# EAGLE design board (EAGLE 6.5.0)
Teensy 3.0 to Arduino R3 compatible shield adapter
Assembly variants: no charger, FULL

## Sheet 1 of 3
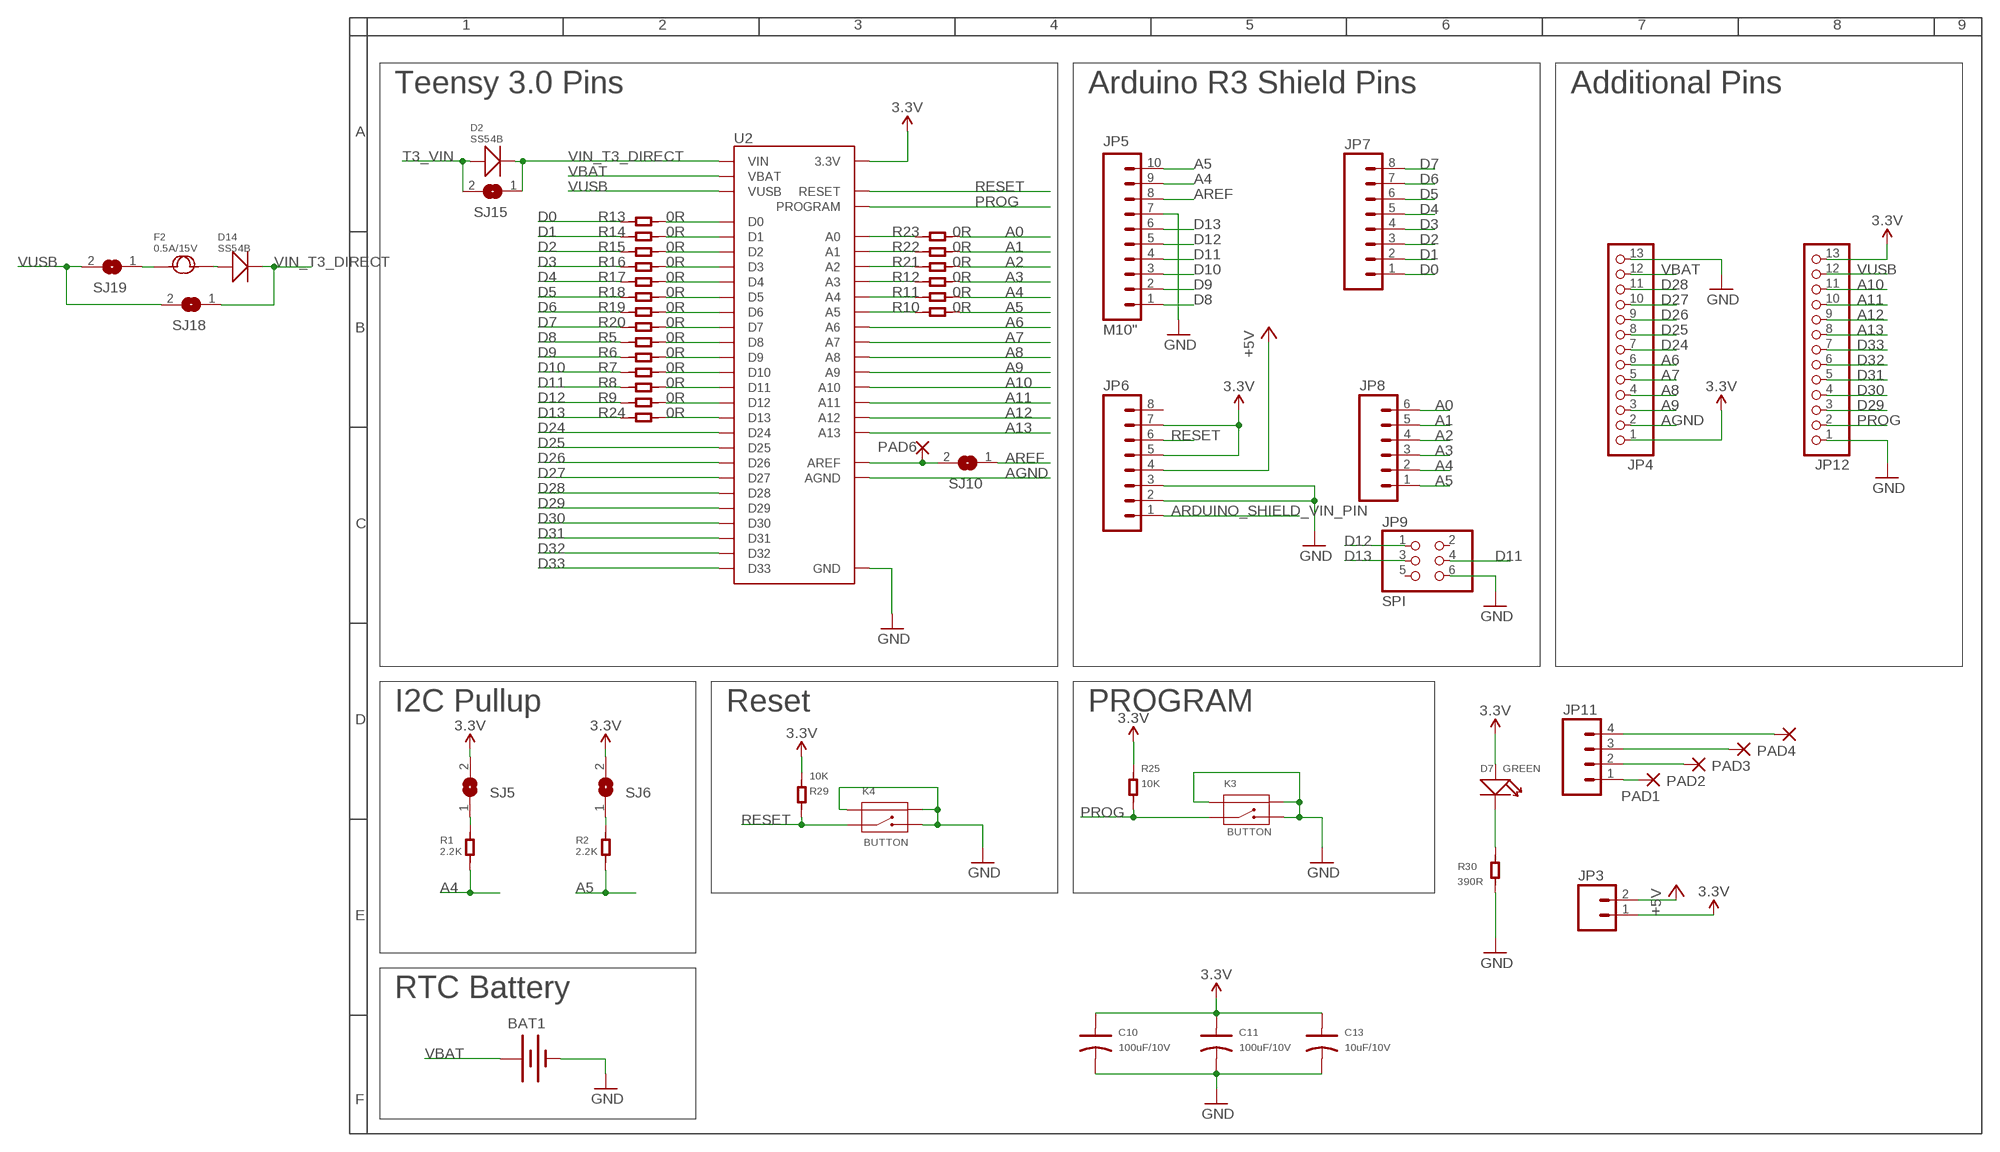
[diagram p0: schematic, sheet 1]

### Parts
BAT1  BATTERY12MM  [BATTCON_12MM]
C10  100uF/10V  C-POLAR-C  [AVX-C]  (not fitted in variant no charger)  (not fitted in variant FULL)
C11  100uF/10V  C-POLAR-C  [AVX-C]  (not fitted in variant no charger)  (not fitted in variant FULL)
C13  10uF/10V  C-POLAR-B  [AVX-B]  (not fitted in variant FULL)
D2  SS54B  D-SMB  [SMB]
D7  GREEN  LED  [LED0603]
D14  SS54B  D-SMB  [SMB]
F2  0.5A/15V  FUSE-1812  [F1812]
JP3  M02PTH  [1X02]
JP4  PINHD-1X13_BIG  [1X13-BIG]
JP5  M10"  [1X10]
JP6  M081X08  [1X08]
JP7  M081X08  [1X08]
JP8  M06SIP  [1X06]
JP9  SPI  PINHD-2X3  [2X03]
JP11  M04PTH  [1X04]
JP12  PINHD-1X13_BIG  [1X13-BIG]
K3  BUTTON  BUTTON-2P-REINFORCE-3100060P1  [4P-SMD-7.0X3.5X3.5H-90D]
K4  BUTTON  BUTTON-2P-REINFORCE-3100060P1  [4P-SMD-7.0X3.5X3.5H-90D]
PAD1  WIREPADSMD1,27-254  [SMD1,27-2,54]
PAD2  WIREPADSMD1,27-254  [SMD1,27-2,54]
PAD3  WIREPADSMD1,27-254  [SMD1,27-2,54]
PAD4  WIREPADSMD1,27-254  [SMD1,27-2,54]
PAD6  AREF  SMD2  [SMD1,27-2,54]
R1  2.2K  R-0603  [R0603]
R2  2.2K  R-0603  [R0603]
R5  0R  R-0603  [R0603]
R6  0R  R-0603  [R0603]
R7  0R  R-0603  [R0603]
R8  0R  R-0603  [R0603]
R9  0R  R-0603  [R0603]
R10  0R  R-0603  [R0603]
R11  0R  R-0603  [R0603]
R12  0R  R-0603  [R0603]
R13  0R  R-0603  [R0603]
R14  0R  R-0603  [R0603]
R15  0R  R-0603  [R0603]
R16  0R  R-0603  [R0603]
R17  0R  R-0603  [R0603]
R18  0R  R-0603  [R0603]
R19  0R  R-0603  [R0603]
R20  0R  R-0603  [R0603]
R21  0R  R-0603  [R0603]
R22  0R  R-0603  [R0603]
R23  0R  R-0603  [R0603]
R24  0R  R-0603  [R0603]
R25  10K  R-0603  [R0603]
R29  10K  R-0603  [R0603]
R30  390R  R-0603  [R0603]
SJ5  JUMPER_2WLARGE  [JUMPER_LARGE_2WAY]
SJ6  JUMPER_2WLARGE  [JUMPER_LARGE_2WAY]
SJ10  JUMPER_2WLARGE  [JUMPER_LARGE_2WAY]
SJ15  JUMPER_2WLARGE  [JUMPER_LARGE_2WAY]
SJ18  JUMPER_2WLARGE  [JUMPER_LARGE_2WAY]
SJ19  JUMPER_2WLARGE  [JUMPER_LARGE_2WAY]
U2  TEENSY3.0_ALLPINSSILK  [TEENSY3.0_ALLPINS/SILK]

### Nets
3.3V [MOREPOWER]: C10.+ C11.+ C13.+ D7.+ JP3.1 JP4.1 JP6.5 JP6.7 JP12.13 R25.2 R29.2 SJ5.2 SJ6.2 U2.3V3_A(3.3V) U2.3V3_B(3.3V) U2.3V3_C(3.3V) ; also sheet 2,3
+5V [MOREPOWER]: JP3.2 JP6.4 ; also sheet 3
A0: JP8.6 R23.1
A1: JP8.5 R22.1
A2: JP8.4 R21.1
A3: JP8.3 R12.1
A4: JP5.9 JP8.2 R1.1 R11.1
A5: JP5.10 JP8.1 R2.1 R10.1
A6: JP4.6 U2.A6
A7: JP4.5 U2.A7
A8: JP4.4 U2.A8
A9: JP4.3 U2.A9
A10: JP12.11 U2.A10
A11: JP12.10 U2.A11
A12: JP12.9 U2.A12
A13: JP12.8 U2.A13
AGND: JP4.2 U2.AGND
ARDUINO_SHIELD_VIN_PIN [MOREPOWER]: JP6.1 ; also sheet 3
AREF: JP5.8 SJ10.1
D0: JP7.1 R13.2 ; also sheet 2
D1: JP7.2 R14.2 ; also sheet 2
D2: JP7.3 R15.2 ; also sheet 2
D3: JP7.4 R16.2
D4: JP7.5 R17.2 ; also sheet 2
D5: JP7.6 R18.2
D6: JP7.7 R19.2 ; also sheet 2,3
D7: JP7.8 R20.2 ; also sheet 3
D8: JP5.1 R5.2 ; also sheet 3
D9: JP5.2 R6.2 ; also sheet 2
D10: JP5.3 R7.2 ; also sheet 2
D11: JP5.4 JP9.4 R8.2 ; also sheet 2
D12: JP5.5 JP9.1 R9.2 ; also sheet 2
D13: JP5.6 JP9.3 R24.2 ; also sheet 2
D24: JP4.7 U2.D24 ; also sheet 2
D25: JP4.8 U2.D25 ; also sheet 2
D26: JP4.9 U2.D26
D27: JP4.10 U2.D27
D28: JP4.11 U2.D28
D29: JP12.3 U2.D29
D30: JP12.4 U2.D30
D31: JP12.5 U2.D31
D32: JP12.6 U2.D32
D33: JP12.7 U2.D33
DIRECT_AREF: PAD6.1(P) SJ10.2 U2.AREF
GND [MOREPOWER]: BAT1.GND(-) C10.- C11.- C13.- JP4.13 JP5.7 JP6.2 JP6.3 JP9.6 JP12.1 K3.2 K3.S1 K3.S2 K4.2 K4.S1 K4.S2 R30.1 U2.GND_A(GND) U2.GND_B(GND) U2.GND_C(GND) ; also sheet 2,3
N$5: R13.1 U2.D0
N$6: R14.1 U2.D1
N$7: R15.1 U2.D2
N$8: R16.1 U2.D3
N$9: R17.1 U2.D4
N$10: R10.2 U2.A5
N$11: R11.2 U2.A4
N$12: R12.2 U2.A3
N$13: R18.1 U2.D5
N$14: R19.1 U2.D6
N$15: R20.1 U2.D7
N$16: R5.1 U2.D8
N$17: R6.1 U2.D9
N$18: R7.1 U2.D10
N$19: R8.1 U2.D11
N$20: R9.1 U2.D12
N$21: R21.2 U2.A2
N$22: R22.2 U2.A1
N$23: R23.2 U2.A0
N$24: R24.1 U2.D13
N$28: R1.2 SJ5.1
N$32: R2.2 SJ6.1
N$34: D7.- R30.2
N$47: JP11.1 PAD1.1(P)
N$49: JP11.2 PAD2.1(P)
N$50: JP11.3 PAD3.1(P)
N$51: JP11.4 PAD4.1(P)
N$59 [POWER]: D14.+ F2.2
N$65 [POWER]: F2.1 SJ19.1
PROG: JP12.2 K3.1 R25.1 U2.PROG(PROGRAM)
RESET: JP6.6 K4.1 R29.1 U2.RESET ; also sheet 3
T3_VIN [POWER]: D2.+ SJ15.2 ; also sheet 3
VBAT: BAT1.PWR@1(+) JP4.12 U2.VBAT
VIN_T3_DIRECT [POWER]: D2.- D14.- SJ15.1 SJ18.1 U2.VIN
VUSB [MOREPOWER]: JP12.12 SJ18.2 SJ19.2 U2.VUSB ; also sheet 3
Unconnected: JP6.8 JP9.2 JP9.5

### Notes on the sheet
- Teensy 3.0 Pins | Arduino R3 Shield Pins | Additional Pins
- I2C Pullup | Reset | PROGRAM
- RTC Battery

## Sheet 2 of 3
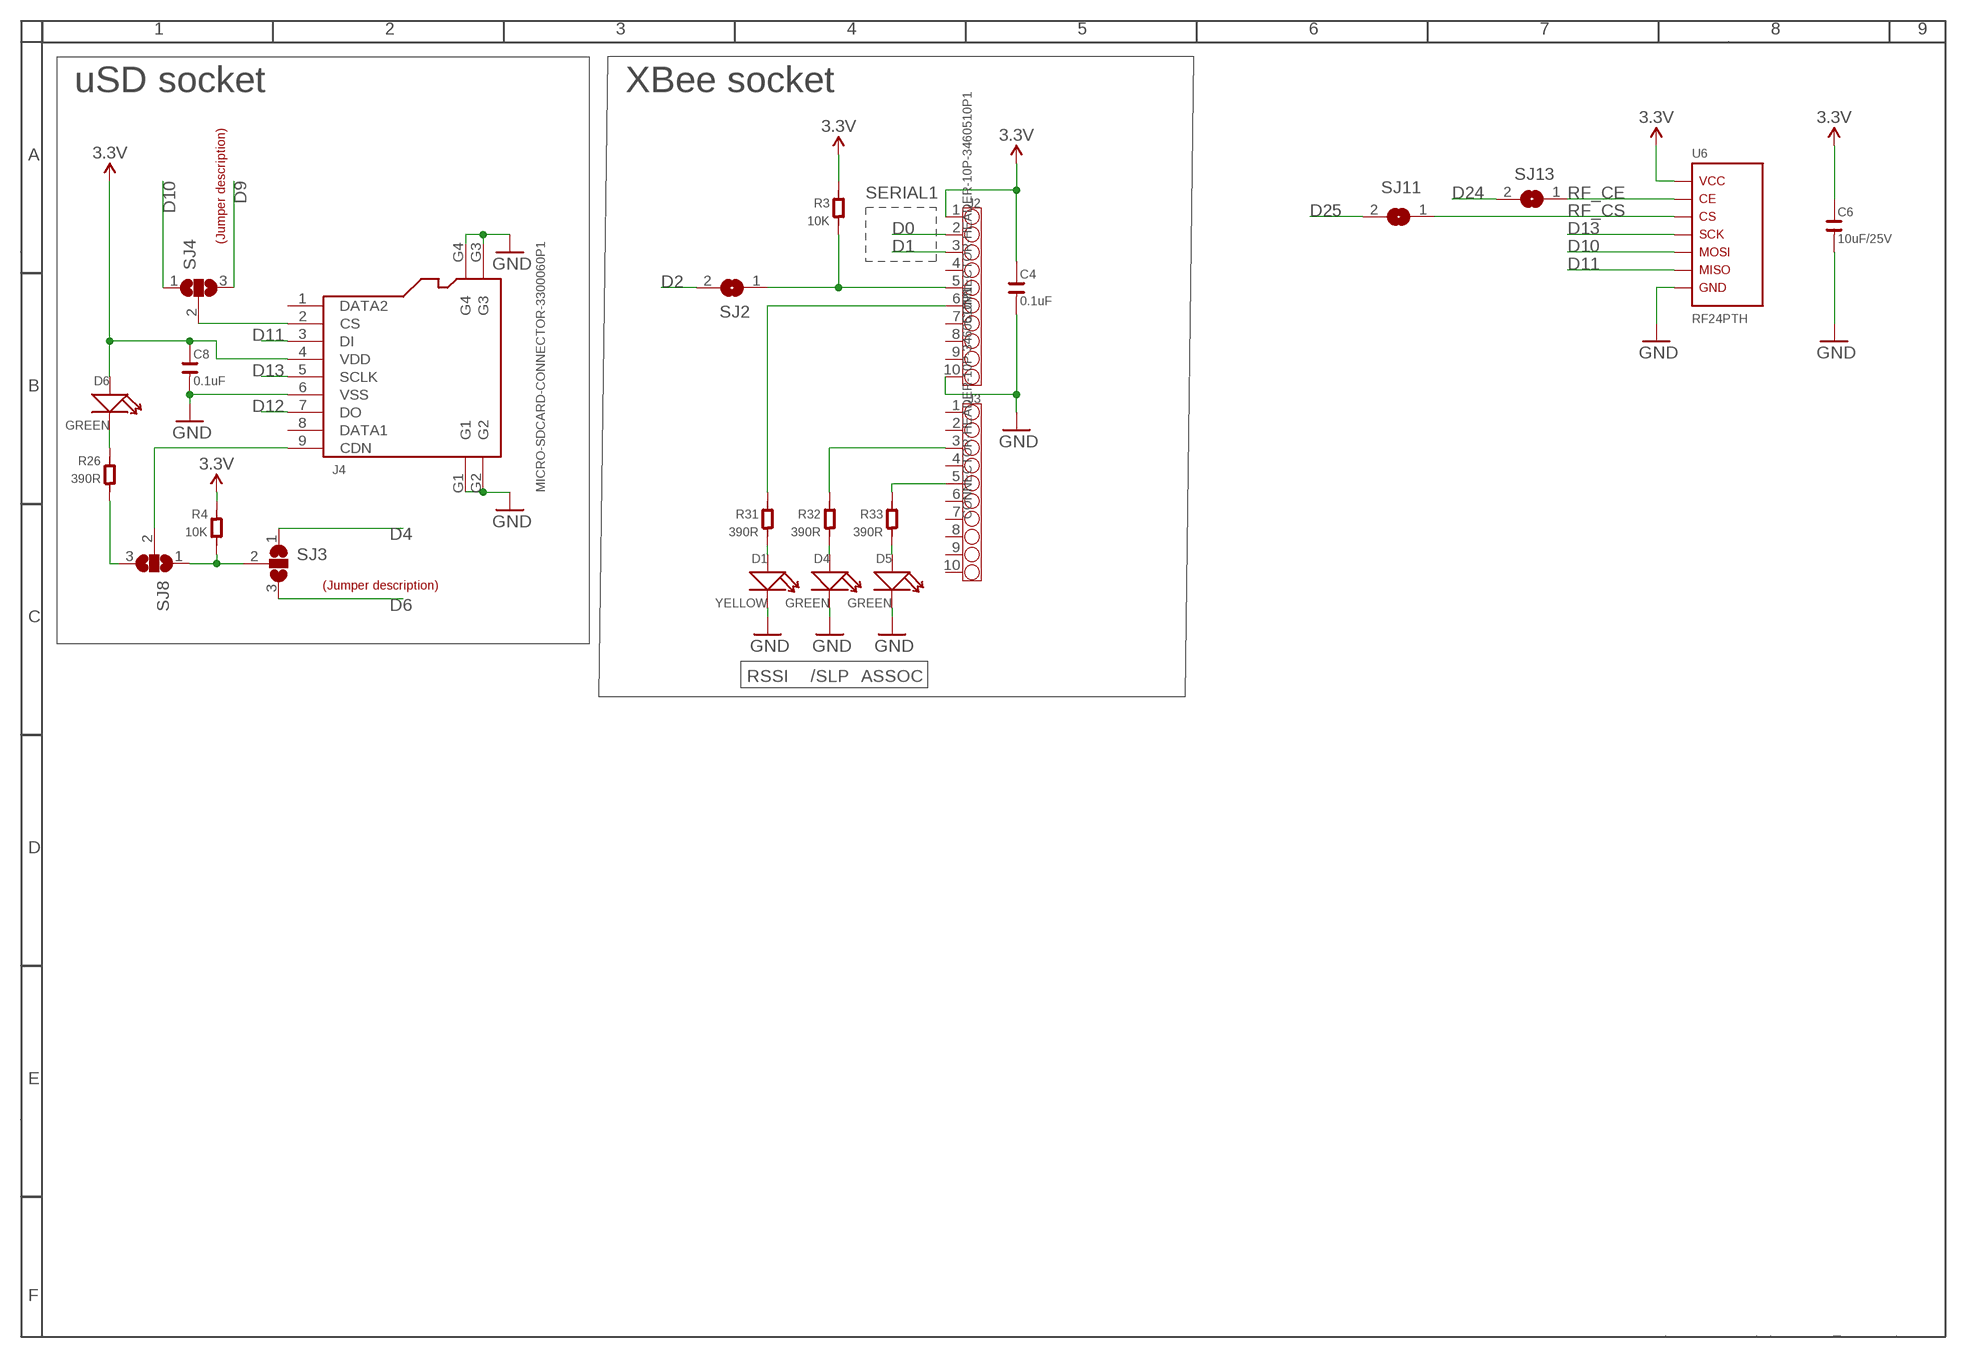
[diagram p1: schematic, sheet 2]

### Parts
C4  0.1uF  C-0603  [C0603]
C6  10uF/25V  C-0805  [C0805]
C8  0.1uF  C-0603  [C0603]
D1  YELLOW  LED  [LED0603]
D4  GREEN  LED  [LED0603]
D5  GREEN  LED  [LED0603]
D6  GREEN  LED  [LED0603]
J2  CONNECTOR-HEADER-10P-3460510P1  [1X10P-2.0-4.3-BLUE-FEMALE]
J3  CONNECTOR-HEADER-10P-3460510P1  [1X10P-2.0-4.3-BLUE-FEMALE]
J4  MICRO-SDCARD-CONNECTOR-3300060P1  [9P-SMD-W-RING]
R3  10K  R-0603  [R0603]
R4  10K  R-0603  [R0603]
R26  390R  R-0603  [R0603]
R31  390R  R-0603  [R0603]
R32  390R  R-0603  [R0603]
R33  390R  R-0603  [R0603]
SJ2  JUMPER_2WSMALL  [JUMPER_SMALL_2WAY]
SJ3  SJ2W  [SJ_2]
SJ4  SJ2W  [SJ_2]
SJ8  SJ2W  [SJ_2]
SJ11  JUMPER_2WSMALL  [JUMPER_SMALL_2WAY]
SJ13  JUMPER_2WSMALL  [JUMPER_SMALL_2WAY]
U6  RF24PTH  [RF24]
U$1  LABEL_JUMPER_1X3  [JUMP3_DESC]
U$2  LABEL_JUMPER_1X3  [JUMP3_DESC]

### Nets
3.3V [MOREPOWER]: C4.2 C6.2 C8.2 D6.+ J2.1 J4.4(VDD) R3.2 R4.1 U6.VCC ; also sheet 1,3
D0: J2.2 ; also sheet 1
D1: J2.3 ; also sheet 1
D2: SJ2.2 ; also sheet 1
D4: SJ3.1 ; also sheet 1
D6: SJ3.3 ; also sheet 1,3
D9: SJ4.3 ; also sheet 1
D10: SJ4.1 U6.MOSI ; also sheet 1
D11: J4.3(DI) U6.MISO ; also sheet 1
D12: J4.7(DO) ; also sheet 1
D13: J4.5(SCLK) U6.SCK ; also sheet 1
D24: SJ13.2 ; also sheet 1
D25: SJ11.2 ; also sheet 1
DFGDFG: J2.5 R3.1 SJ2.1
ESDASGGGG: R4.2 SJ3.2 SJ8.1
GND [MOREPOWER]: C4.1 C6.1 C8.1 D1.- D4.- D5.- J2.10 J4.6(VSS) J4.G1 J4.G2 J4.G3 J4.G4 U6.GND ; also sheet 1,3
N$2: J3.5 R33.2
N$3: D1.+ R31.1
N$25: D4.+ R32.1
N$26: J3.3 R32.2
N$29: D5.+ R33.1
N$30: R26.1 SJ8.3
N$31: J2.6 R31.2
N$33: D6.- R26.2
N$35: J4.9(CDN) SJ8.2
N$37: J4.2(CS) SJ4.2
RF_CE: SJ13.1 U6.CE
RF_CS: SJ11.1 U6.CS
Unconnected: J2.4 J2.7 J2.8 J2.9 J3.1 J3.2 J3.4 J3.6 J3.7 J3.8 J3.9 J3.10 J4.1(DATA2) J4.8(DATA1)

### Notes on the sheet
- uSD socket | XBee socket
- SERIAL1
- RSSI | /SLP | ASSOC

## Sheet 3 of 3
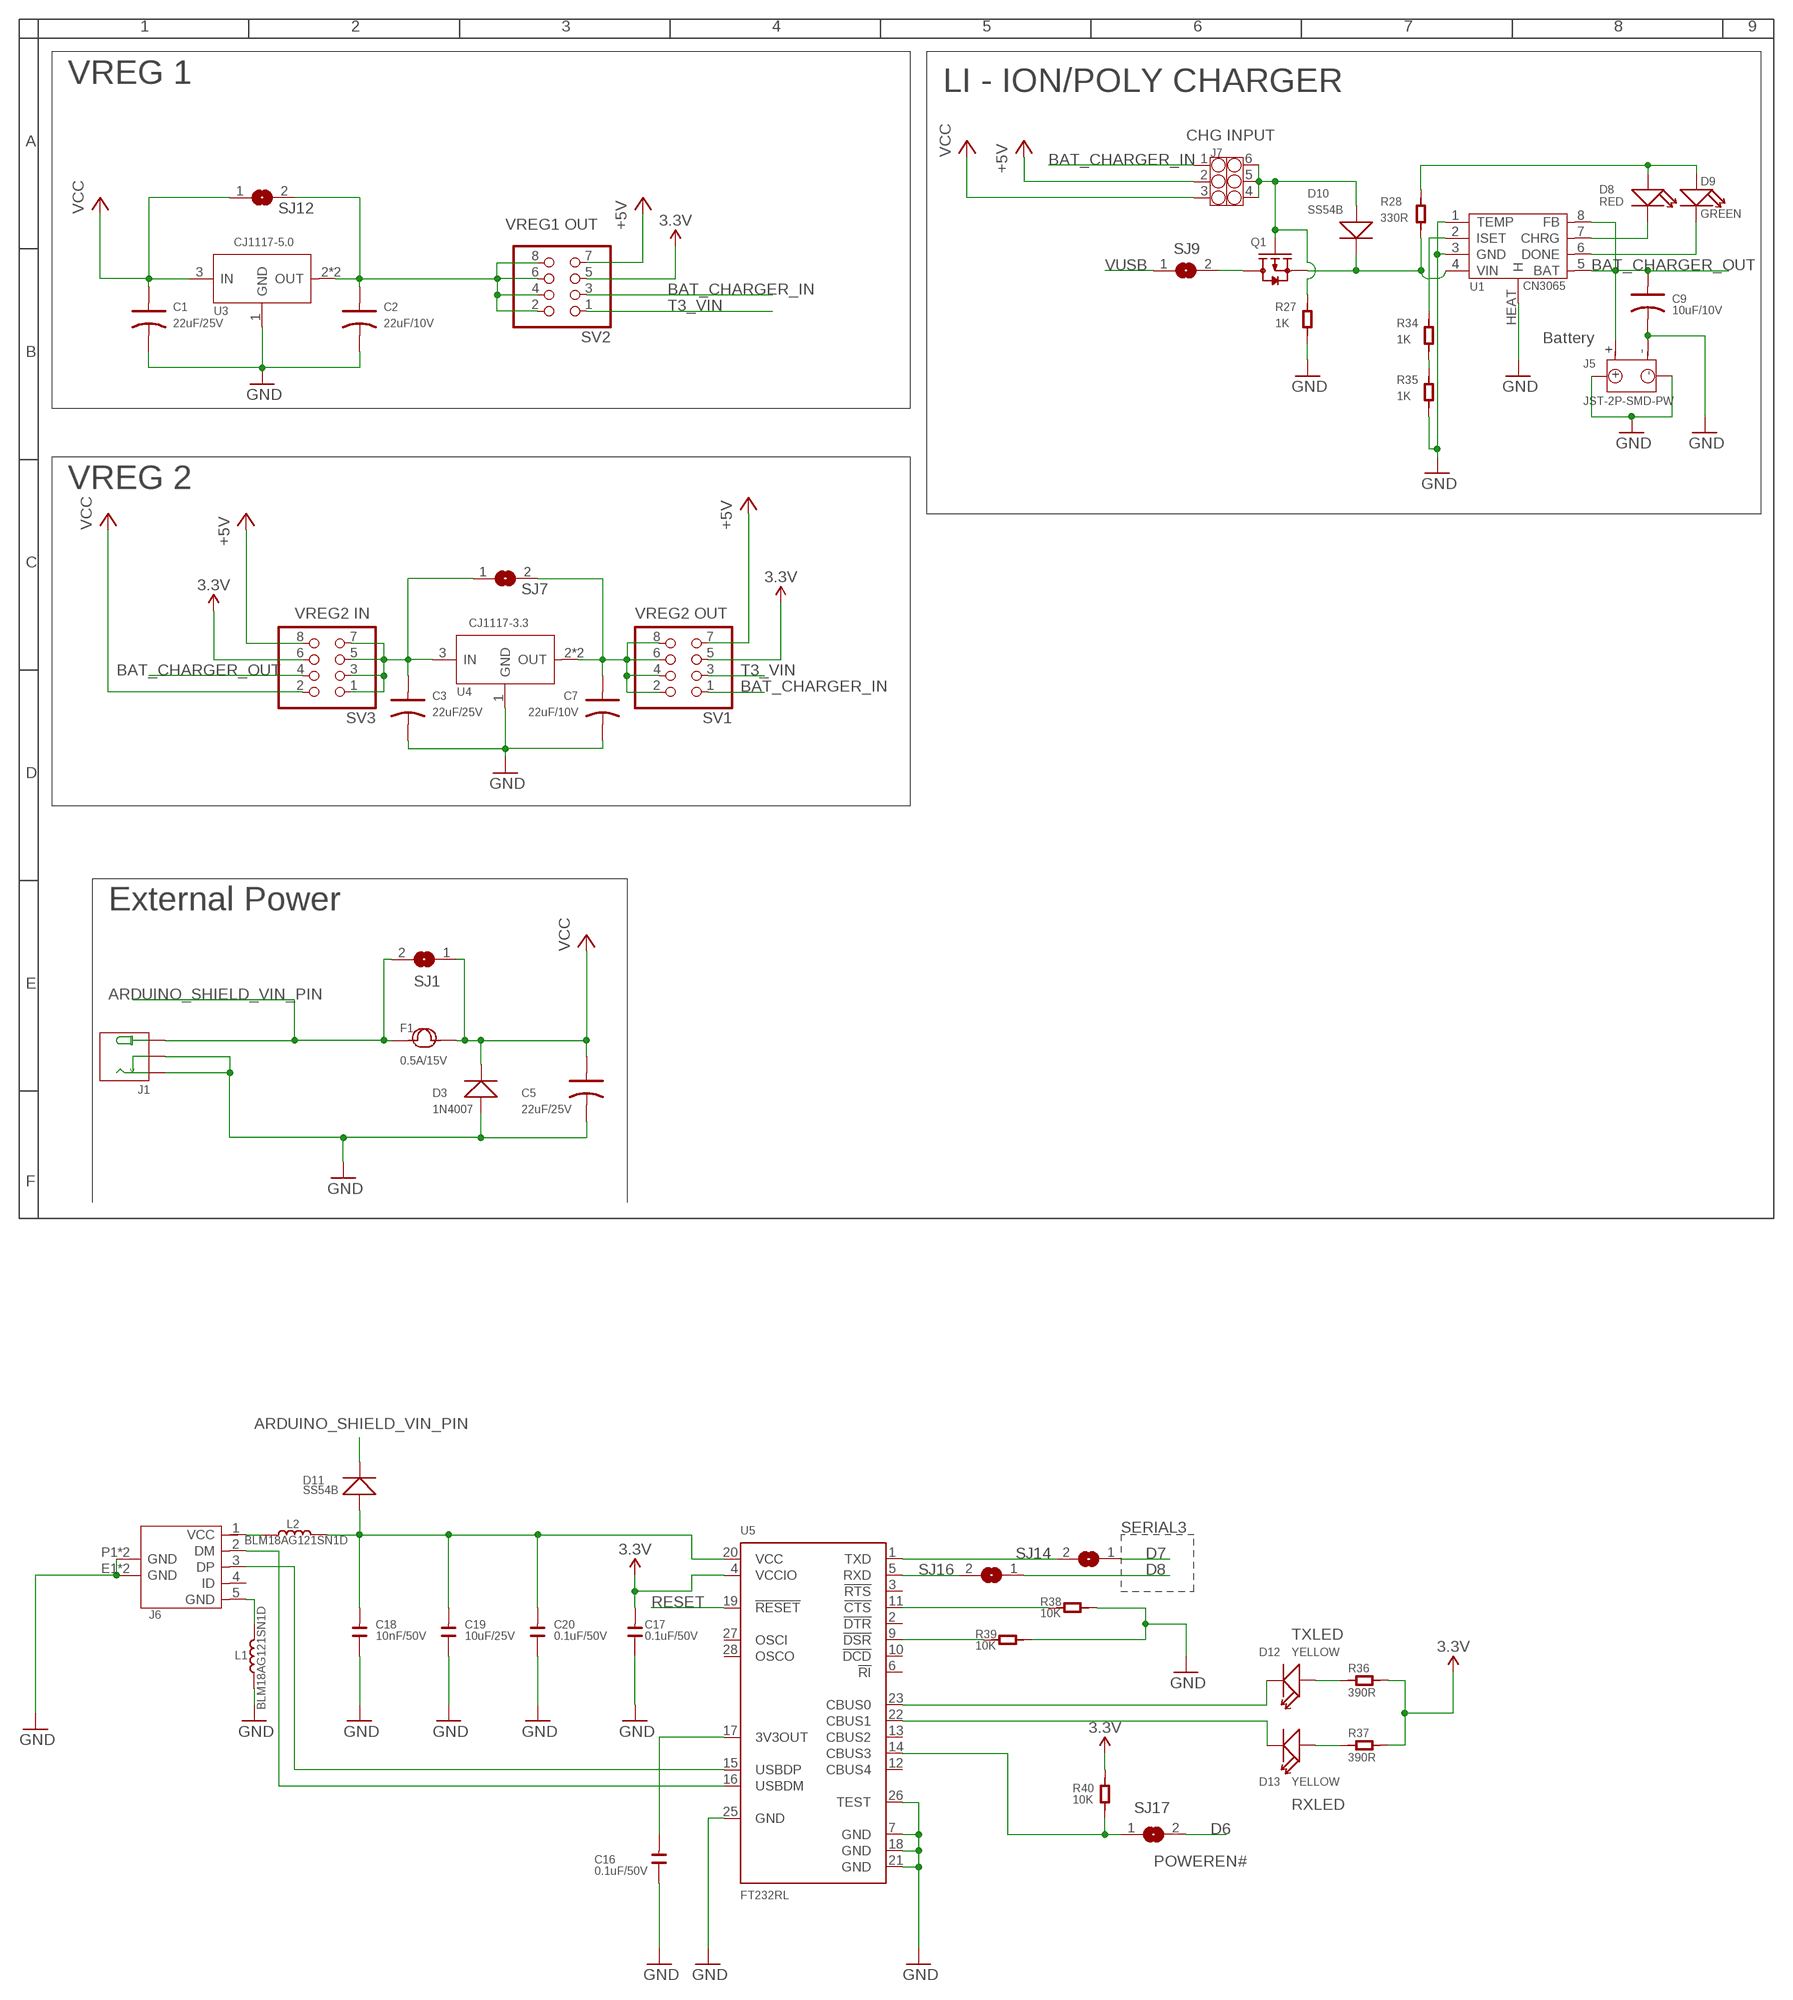
[diagram p2: schematic, sheet 3]

### Parts
C1  22uF/25V  C-POLAR-C  [AVX-C]
C2  22uF/10V  C-POLAR-B  [AVX-B]
C3  22uF/25V  C-POLAR-C  [AVX-C]
C5  22uF/25V  C-POLAR-C  [AVX-C]
C7  22uF/10V  C-POLAR-B  [AVX-B]
C9  10uF/10V  C-POLAR-A  [AVX-A]  (not fitted in variant no charger)  (not fitted in variant FULL)
C16  0.1uF/50V  C-0603  [C0603]
C17  0.1uF/50V  C-0603  [C0603]
C18  10nF/50V  C-0603  [C0603]
C19  10uF/25V  C-0805  [C0805]
C20  0.1uF/50V  C-0603  [C0603]
D3  1N4007  D-SMA  [DO-214AC]
D8  RED  LED  [LED0603]  (not fitted in variant no charger)
D9  GREEN  LED  [LED0603]  (not fitted in variant no charger)
D10  SS54B  D-SMB  [SMB]  (not fitted in variant no charger)
D11  SS54B  D-SMB  [SMB]
D12  YELLOW  LED  [LED0603]
D13  YELLOW  LED  [LED0603]
F1  0.5A/15V  FUSE-1812  [F1812]
J1  JACK-DC-3P-3410020P1  [PW-3P-2.1]
J5  JST-2P-SMD-PW  JST-2P-SMD-PW-3410050P1  [2P-SMD-2.0-90D]  (not fitted in variant no charger)
J6  MICRO-USB-5P-3400150P1  [B-SMD-5P]
J7  CONNECTOR-HEADER-2X3P-3460180P1  [2X3P-2.54-2.54-11.6-3.0-BLACK-MALE]  (not fitted in variant no charger)
L1  BLM18AG121SN1D  L-0603  [L0603]
L2  BLM18AG121SN1D  L-0603  [L0603]
Q1  MOSFET-P-0440210P1  [SOT23]  (not fitted in variant no charger)
R27  1K  R-0603  [R0603]  (not fitted in variant no charger)
R28  330R  R-0603  [R0603]  (not fitted in variant no charger)
R34  1K  R-0603  [R0603]  (not fitted in variant no charger)
R35  1K  R-0603  [R0603]  (not fitted in variant no charger)
R36  390R  R-0603  [R0603]
R37  390R  R-0603  [R0603]
R38  10K  R-0603  [R0603]
R39  10K  R-0603  [R0603]
R40  10K  R-0603  [R0603]
SJ1  JUMPER_2WLARGE  [JUMPER_LARGE_2WAY]
SJ7  JUMPER_2WLARGE  [JUMPER_LARGE_2WAY]
SJ9  JUMPER_2WLARGE  [JUMPER_LARGE_2WAY]
SJ12  JUMPER_2WLARGE  [JUMPER_LARGE_2WAY]
SJ14  JUMPER_2WLARGE  [JUMPER_LARGE_2WAY]
SJ16  JUMPER_2WLARGE  [JUMPER_LARGE_2WAY]
SJ17  JUMPER_2WLARGE  [JUMPER_LARGE_2WAY]
SV1  PINHD-2X4_2.54  [2X04]
SV2  PINHD-2X4_2.54  [2X04]
SV3  PINHD-2X4_2.54  [2X04]
U1  CN3065  CN3065-1320040P1  [DFN8]  (not fitted in variant no charger)
U3  CJ1117-5.0  CJ1117-5.0-1310170P1  [SOT223]
U4  CJ1117-3.3  CJ1117-3.3-1310190P1  [SOT223]
U5  FT232RL  FT232RL-1720010P1  [SSOP28]

### Nets
3.3V [MOREPOWER]: C17.1 R36.2 R37.2 R40.2 SV1.5 SV2.5 SV3.6 U5.4(VCCIO) ; also sheet 1,2
+5V [MOREPOWER]: J7.2 SV1.7 SV2.7 SV3.8 ; also sheet 1
ARDUINO_SHIELD_VIN_PIN [MOREPOWER]: D11.- F1.1 J1.+ SJ1.2 ; also sheet 1
BAT_CHARGER_IN [POWER]: J7.1 SV1.1 SV2.3
BAT_CHARGER_OUT [MOREPOWER]: C9.+ J5.+ SV3.4 U1.5(BAT) U1.8(FB)
D6: SJ17.2 ; also sheet 1,2
D7: SJ14.1 ; also sheet 1
D8: SJ16.1 ; also sheet 1
GND [MOREPOWER]: C1.- C2.- C3.- C5.- C7.- C9.- C16.2 C17.2 C18.2 C19.2 C20.2 D3.1(+) J1.-1(-) J1.-2(CDN) J5.3 J5.4 J5.- J6.E1(GND) J6.E2(GND) J6.P1(GND) J6.P2(GND) L1.1 R27.1 R35.1 R38.2 R39.2 U1.1(TEMP) U1.3(GND) U1.HEAT(H) U3.1(GND) U4.1(GND) U5.7(GND) U5.18(GND) U5.21(GND) U5.25(GND) U5.26(TEST) ; also sheet 1,2
N$1 [MOREPOWER]: C3.+ SJ7.1 SV3.1 SV3.3 SV3.5 SV3.7 U4.3(IN)
N$27 [MOREPOWER]: C7.+ SJ7.2 SV1.2 SV1.4 SV1.6 SV1.8 U4.2(OUT) U4.TER(OUT)
N$36 [MOREPOWER]: D10.- Q1.2(S) R28.1 U1.4(VIN)
N$38 [MOREPOWER]: C18.1 C19.1 C20.1 D11.+ L2.2 U5.20(VCC)
N$39: D8.- U1.7(CHRG)
N$40: D9.- U1.6(DONE)
N$41: D8.+ D9.+ R28.2
N$42: R34.2 U1.2(ISET)
N$43: Q1.3(D) SJ9.2
N$44: J6.2(DM) U5.16(USBDM)
N$45: J6.3(DP) U5.15(USBDP)
N$46: R38.1 U5.11(!CTS)
N$48: R39.1 U5.9(!DSR)
N$52: SJ14.2 U5.1(TXD)
N$53 [MOREPOWER]: C2.+ SJ12.2 SV2.2 SV2.4 SV2.6 SV2.8 U3.2(OUT) U3.TER(OUT)
N$54: SJ16.2 U5.5(RXD)
N$55: D12.- U5.23(CBUS0)
N$56 [MOREPOWER]: R40.1 SJ17.1 U5.14(CBUS3)
N$57: D13.- U5.22(CBUS1)
N$58: R34.1 R35.2
N$60: C16.1 U5.17(3V3OUT)
N$61: D12.+ R36.1
N$62: D13.+ R37.1
N$63 [MOREPOWER]: J6.5(GND) L1.2
N$64: J6.1(VCC) L2.1
NET45456 [POWER]: D10.+ J7.4 J7.5 J7.6 Q1.1(G) R27.2
RESET: U5.19(!RESET) ; also sheet 1
T3_VIN [POWER]: SV1.3 SV2.1 ; also sheet 1
VCC [MOREPOWER]: C1.+ C5.+ D3.2(-) F1.2 J7.3 SJ1.1 SJ12.1 SV3.2 U3.3(IN)
VUSB [MOREPOWER]: SJ9.1 ; also sheet 1
Unconnected: J6.4(ID) U5.2(!DTR) U5.3(!RTS) U5.6(!RI) U5.10(!DCD) U5.12(CBUS4) U5.13(CBUS2) U5.27(OSCI) U5.28(OSCO)

### Notes on the sheet
- VREG 1 | LI - ION/POLY CHARGER
- CHG INPUT
- VREG1 OUT
- Battery
- VREG 2
- VREG2 IN | VREG2 OUT
- External Power
- SERIAL3
- TXLED
- RXLED
- POWEREN#

## Library data of the parts
BAT1 = SparkFun-Electromechanical:BATTERY: Battery Holders Various common sizes : AA, AAA, 20mm coin cell and 12mm coin cell. 20MM_4LEGS, BATT-10373
C1 C3 = OPL:C-POLAR*; MPN: TAJC226K025RNJ; SKU: 0130360P1
C2 C7 = OPL:C-POLAR*; SKU: 0130240P1
C4 C8 C16 C17 C20 = OPL:C*; SKU: 0100020P1
C5 = OPL:C-POLAR*; SKU: 0130360P1
C6 C19 = OPL:C*; SKU: 0100080P1
C9 = OPL:C-POLAR*; SKU: 0130040P1
C10 C11 = OPL:C-POLAR*; SKU: 0130170P1
C13 = OPL:C-POLAR*; SKU: 0130100P1
C18 = OPL:C*; SKU: 0100350P1
D1 D12 D13 = OPL:LED*: LED; SKU: 0330050P1
D2 D10 D11 D14 = OPL:D*: DIODE; SKU: 0310130P1
D3 = OPL:D*: DIODE; SKU: 0300040P1
D4-D7 D9 = OPL:LED*: LED; SKU: 0330010P1
D8 = OPL:LED*: LED; SKU: 0330020P1
F1 = OPL:FUSE*; SKU: 0900390P1
F2 = OPL_20130807:FUSE*; SKU: 0900390P1
J1 = OPL:JACK-DC-3P; SKU: 3410020P1
J2 J3 = OPL:CONNECTOR-HEADER-10P; SKU: 3460510P1
J4 = OPL:MICRO-SDCARD-CONNECTOR: Micro SD Card; SKU: 3300060P1
J5 = OPL:JST-2P-SMD-PW; SKU: 3410050P1
J6 = OPL:MICRO-USB-5P: ST-USB-001E：MICRO USB B SMD R/A; SKU: 3400150P1
J7 = OPL:CONNECTOR-HEADER-2X3P
JP3 = SparkFun-Connectors:M02: Header 2 Standard 2-pin 0.1" header. Use with straight break away headers (SKU : PRT-00116), right angle break away headers (PRT-00553), swiss pins (PRT-00743), machine pins (PRT-00117), and female headers (PRT-00115). Molex polarized connector foot print use with SKU : PRT-08233 with associated crimp pins and housings.
JP4 JP12 = adafruit:PINHD-1X13: PIN HEADER
JP5 = SparkFun-Connectors:M10: Header 10 Standard 10-pin 0.1" header. Use with straight break away headers (SKU : PRT-00116), right angle break away headers (PRT-00553), swiss pins (PRT-00743), machine pins (PRT-00117), and female headers (PRT-00115).
JP6 JP7 = SparkFun-Connectors:M08: Header 8 Standard 8-pin 0.1" header. Use with straight break away headers (SKU : PRT-00116), right angle break away headers (PRT-00553), swiss pins (PRT-00743), machine pins (PRT-00117), and female headers (PRT-00115).
JP8 = SparkFun-Connectors:M06: Header 6 Standard 6-pin 0.1" header. Use with straight break away headers (SKU : PRT-00116), right angle break away headers (PRT-00553), swiss pins (PRT-00743), machine pins (PRT-00117), and female headers (PRT-00115). Molex polarized connector foot print use with SKU : PRT-08094 with associated crimp pins and housings. NOTES ON THE VARIANTS LOCK and LOCK_LONGPADS... This footprint was designed to help hold the alignment of a through-hole component (i.e. 6-pin header) while soldering it into place. You may notice that each hole has been shifted either up or down by 0.005 of an inch from it's more standard position (which is a perfectly straight line). This slight alteration caused the pins (the squares in the middle) to touch the edges of the holes. Because they are alternating, it causes a "brace" to hold the component in place. 0.005 has proven to be the perfect amount of "off-center" position when using our standard breakaway headers. Although looks a little odd when you look at the bare footprint, once you have a header in there, the alteration is very hard to notice. Also, if you push a header all the way into place, it is covered up entirely on the bottom side. This idea of altering the position of holes to aid alignment will be further integrated into the Sparkfun Library for other footprints. It can help hold any component with 3 or more connection pins.
JP9 = SparkFun-Connectors:PINHD-2X3: PIN HEADER
JP11 = SparkFun-Connectors:M04: Header 4 Standard 4-pin 0.1" header. Use with straight break away headers (SKU : PRT-00116), right angle break away headers (PRT-00553), swiss pins (PRT-00743), machine pins (PRT-00117), and female headers (PRT-00115). Molex polarized connector foot print use with SKU : PRT-08231 with associated crimp pins and housings. 1MM SMD Version SKU: PRT-10208
K3 K4 = OPL:BUTTON-2P-REINFORCE: TS-1188E http://www.best-dz.com/?thread-374-2.html SMD Button; SKU: 3100060P1
L1 L2 = OPL:L*; SKU: 0900120P1
PAD1-PAD4 = wirepad:WIREPAD: Wire PAD connect wire on PCB
PAD6 = wirepad:SMD2: SMD PAD
Q1 = OPL:MOSFET-P: CJ2305：SMD MOSFET P-CH 8V-4.1A; SKU: 0440210P1
R1 R2 = OPL:R*; SKU: ???
R3 R4 R25 R29 R38-R40 = OPL:R*; SKU: 0011240P1
R5-R24 = OPL:R*; SKU: 0010070P1
R26 R30-R33 R36 R37 = OPL:R*; SKU: 0010600P1
R27 R34 R35 = OPL:R*; SKU: 0011090P1
R28 = OPL:R*; SKU: 0010430P1
SJ1 SJ2 SJ5-SJ7 SJ9-SJ19 = thewknd:JUMPER_2W
SJ3 SJ4 SJ8 = jumper:SJ2W: SMD solder JUMPER
SV1-SV3 = pinhead2:PINHD-2X4: PIN HEADER
U1 = OPL:CN3065: USB-Compatible Lithiumt-Ion Battery Charger with Thermal Regulation http://www.consonance-elec.com/pdf/%E6%8A%80%E6%9C%AF%E8%AF%B4%E6%98%8E%E4%B9%A6/DSC-CN3065.pdf; SKU: 1320040P1
U2 = tlib:TEENSY3.0_ALLPINS
U3 = OPL:CJ1117-5.0; SKU: 1310170P1
U4 = OPL:CJ1117-3.3: 1A Low Dropout Linear Regulator; SKU: 1310190P1
U5 = OPL:FT232RL: USB UART IC Source: http://www.ftdichip.com/Documents/DataSheets/DS_FT232R_v104.pdf; SKU: 1720010P1
U6 = thewknd:RF24
U$1 = dp_devices:LABEL_JUMPER_1X3: Nice formatted three legged jumperdescription Use attributes to change the values LEFT = With jumper to the left RIGHT = With jumper to the right; LEFT: D4; RIGHT: D6
U$2 = dp_devices:LABEL_JUMPER_1X3: Nice formatted three legged jumperdescription Use attributes to change the values LEFT = With jumper to the left RIGHT = With jumper to the right; LEFT: D9; RIGHT: D10

## Net classes
0 default: width 0.152 mm, drill 0.33 mm, clearance 0.203 mm
1 POWER: width 0.406 mm, drill 0.508 mm, clearance 0.254 mm
2 MOREPOWER: width 0.61 mm, drill 0.33 mm, clearance 0.305 mm

## Board
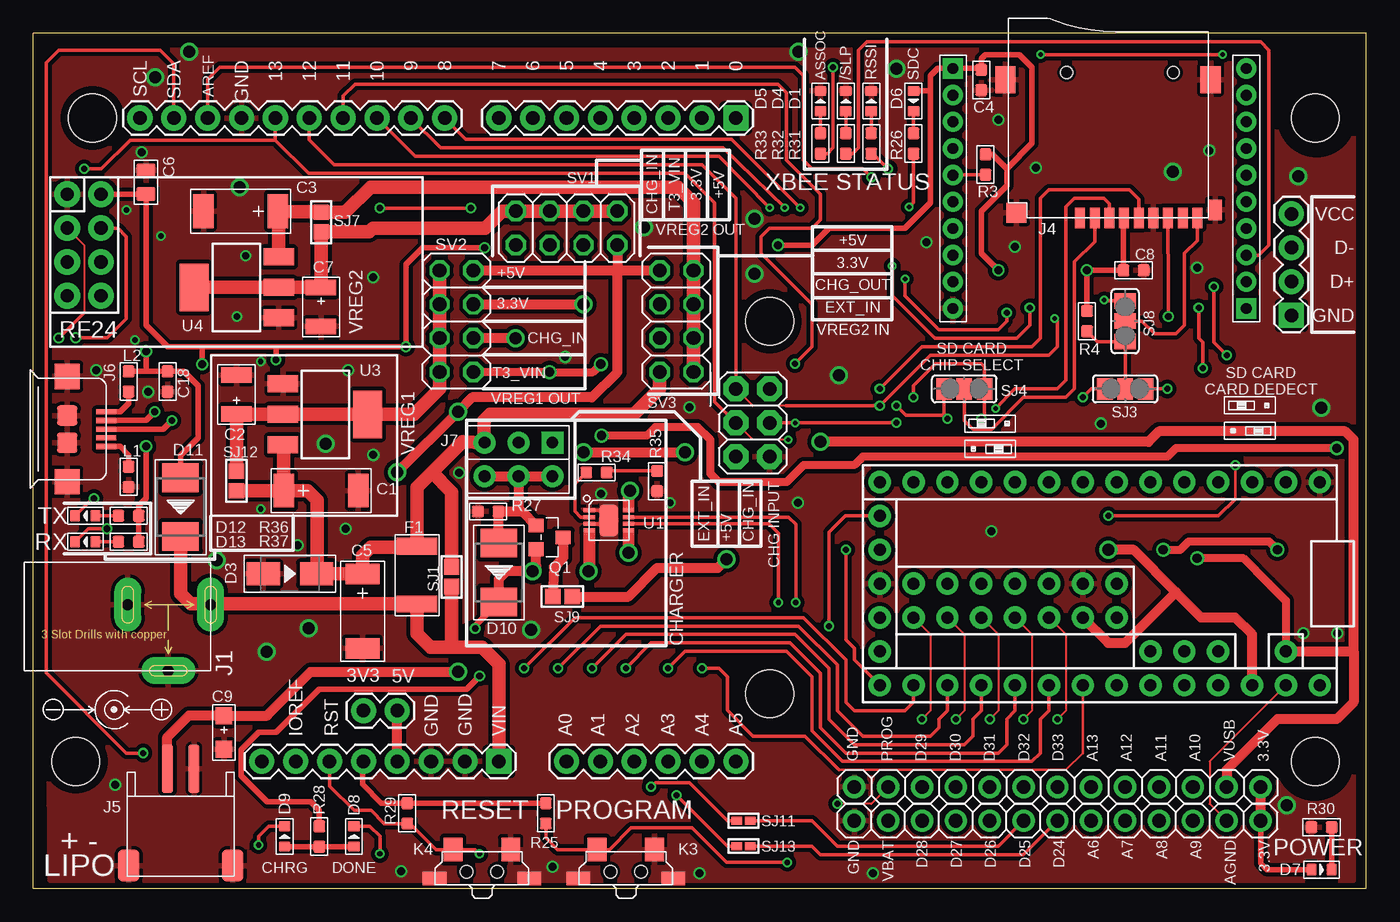
[diagram p3: board, top side]
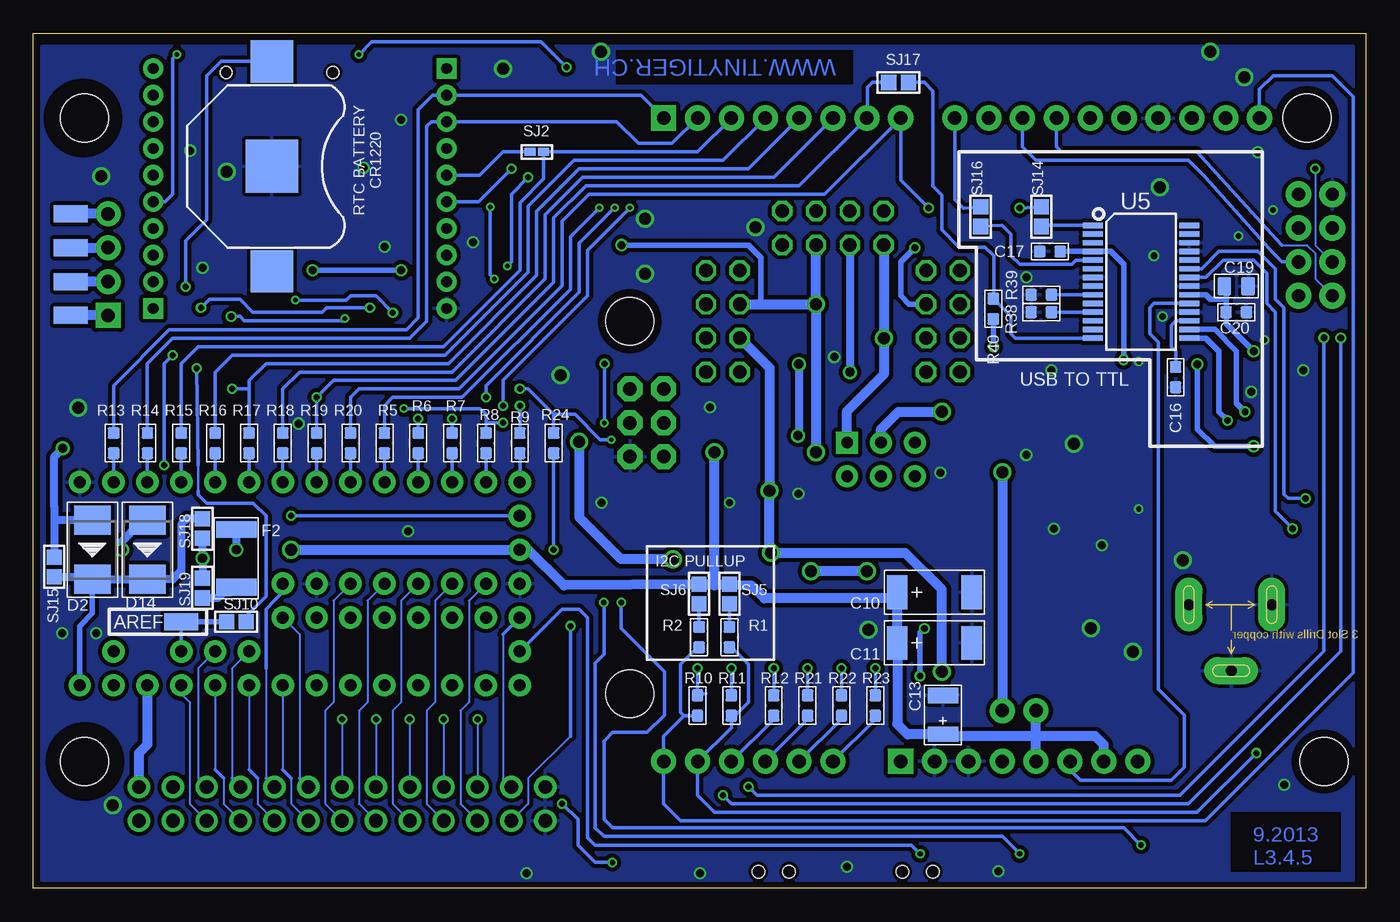
[diagram p4: board, bottom side, seen from below]

Size 100 x 64.14 mm. Coordinates in mm from the lower left corner, seen from the top.
Outline: 0,64.12 100,64.12 100,0 0,0 0,64.14
Copper layers (1*16): Top 0.035mm / dielectric 1.5mm / Bottom 0.035mm
Design rules "Fusion_seeedstudio_rule_v1.1": minimum track width 6mil, minimum drill 12mil, track to track 6mil, track to pad 6mil, pad to pad 6mil, via to via 6mil, smd to smd 0mil, copper to edge 10mil, drill to drill 10mil, minimum pad ring 10mil, minimum via ring 6mil, stop-mask expansion 2mil, vias tented up to drill 100mil, thermal gap 10mil
Holes 3.6 mm at 4.45,57.78 55.24,42.55 55.24,14.61 3.17,9.53 96.17,9.53 96.17,57.78
tKeepout: area 2.2,55.5 to 6.7,60.1; area 53,40.3 to 57.5,44.8; area 53,12.3 to 57.5,16.9; area 0.9,7.2 to 5.5,11.8
bKeepout: area 0.9,7.2 to 5.5,11.8; area 53,12.3 to 57.5,16.9; area 53,40.3 to 57.5,44.8; area 2.2,55.5 to 6.7,60.1
tRestrict: area 93.3,6.7 to 99,12.4; area 93.4,54.9 to 99.1,60.6; area 53,40.3 to 57.5,44.8; area 53,12.3 to 57.5,16.9; area 0.9,7.2 to 5.5,11.8; area 2.2,55.5 to 6.7,60.1
bRestrict: area 2.2,55.5 to 6.7,60.1; area 0.9,7.2 to 5.5,11.8; area 53,12.3 to 57.5,16.9; area 53,40.3 to 57.5,44.8; area 93.4,54.9 to 99.1,60.6; area 93.3,6.7 to 99,12.4; area 38.5,60.3 to 56.3,62.9; area 1.9,1.3 to 10.2,5.7

### Footprints (pad centres in the part's own frame; a part is rotated, then mirrored left to right if it is on the bottom)
BATTCON_12MM = smd 3.962 x 3.962: GND 0,0 | smd 3.175 x 3.175: PWR@1 -7.874,0; PWR@2 7.874,0
AVX-C = smd 1.524 x 2.54: + -2.794,0; - 2.794,0
AVX-B = smd 1.143 x 2.286: + -1.46,0; - 1.46,0
C0603 = smd 0.889 x 0.889: 1 -0.762,0; 2 0.762,0
C0805 = smd 1.016 x 1.397: 1 -0.889,0; 2 0.889,0
AVX-A = smd 1.27 x 1.27: + -1.27,0; - 1.27,0
LED0603 = smd 0.762 x 0.889: + -0.762,0; - 0.762,0
SMB = smd 2.159 x 2.743: + -2.21,0; - 2.21,0
DO-214AC = smd 2.5 x 1.7: 1 -2,0; 2 2,0
F1812 = smd 1.27 x 3.048: 1 -2.159,0; 2 2.159,0
PW-3P-2.1 = drill 0.813 pad 2.032 long: + 6.985,0.889; -1 0.762,0.889; -2 3.81,-4.064
1X10P-2.0-4.3-BLUE-FEMALE = drill 0.813 pad 1.524 square: 1 0,9 | drill 0.813 pad 1.524: 2 0,7; 3 0,5; 4 0,3; 5 0,1; 6 0,-1; 7 0,-3; 8 0,-5; 9 0,-7; 10 0,-9
9P-SMD-W-RING = smd 1.524 x 0.762: 1 -7.493,2.114; 2 -7.493,1.014; 3 -7.493,-0.086; 4 -7.493,-1.186; 5 -7.493,-2.286; 6 -7.493,-3.386; 7 -7.493,-4.486; 8 -7.493,-5.586; 9 -7.493,-6.686 | smd 1.524 x 1.016: G1 -6.893,-8.032 | smd 2.032 x 1.524: G2 2.88,-7.686; G3 2.88,7.714 | smd 1.524 x 1.524: G4 -7.101,6.895 | hole 0.889: 3.407,-4.886; 3.407,3.114
2P-SMD-2.0-90D = smd 1.6 x 2.4: 3 3.9,-2.181; 4 -3.9,-2.181 | smd 0.8 x 3.6: + -1,5.08; - 1,5.08
B-SMD-5P = smd 0.38 x 1.52: 1 -1.3,2.54; 2 -0.65,2.54; 3 0,2.54; 4 0.65,2.54; 5 1.3,2.54 | smd 1.524 x 1.524: E1 -1.016,-0.381; E2 1.016,-0.381 | smd 1.9 x 1.9: P1 -3.95,-0.381; P2 3.95,-0.381
2X3P-2.54-2.54-11.6-3.0-BLACK-MALE = drill 0.889 pad 1.651 square: 1 -1.27,2.54 | drill 0.889 pad 1.651: 2 -1.27,0; 3 -1.27,-2.54; 4 1.27,-2.54; 5 1.27,0; 6 1.27,2.54
1X02 = drill 1.016 pad 1.88: 1 0,0; 2 2.54,0
1X13-BIG = drill 1.016 pad 1.676: 1 -15.24,0; 2 -12.7,0; 3 -10.16,0; 4 -7.62,0; 5 -5.08,0; 6 -2.54,0; 7 0,0; 8 2.54,0; 9 5.08,0; 10 7.62,0; 11 10.16,0; 12 12.7,0; 13 15.24,0
1X10 = drill 1.016 pad 1.88: 1 0,0; 2 2.54,0; 3 5.08,0; 4 7.62,0; 5 10.16,0; 6 12.7,0; 7 15.24,0; 8 17.78,0; 9 20.32,0; 10 22.86,0
1X08 = drill 1.016 pad 1.88 square: 1 0,0 | drill 1.016 pad 1.88: 2 2.54,0; 3 5.08,0; 4 7.62,0; 5 10.16,0; 6 12.7,0; 7 15.24,0; 8 17.78,0
1X06 = drill 1.016 pad 1.88: 1 0,0; 2 2.54,0; 3 5.08,0; 4 7.62,0; 5 10.16,0; 6 12.7,0
2X03 = drill 1.016 pad 1.88 octagon: 1 -2.54,-1.27; 2 -2.54,1.27; 3 0,-1.27; 4 0,1.27; 5 2.54,-1.27; 6 2.54,1.27
1X04 = drill 1.016 pad 1.88 square: 1 0,0 | drill 1.016 pad 1.88: 2 2.54,0; 3 5.08,0; 4 7.62,0
4P-SMD-7.0X3.5X3.5H-90D = smd 1.397 x 1.778: 1 -2.159,1.651; 2 2.159,1.651 | smd 1.778 x 1.016: S1 -3.556,-0.508; S2 3.556,-0.508 | hole 0.95: -1.15,0; 1.15,0
L0603 = smd 0.889 x 0.889: 1 -0.762,0; 2 0.762,0
SMD1,27-2,54 = smd 1.27 x 2.54: 1 0,0
SOT23 = smd 1.016 x 1.143: 1 -0.889,-1.016; 2 0.889,-1.016; 3 0,1.016
R0603 = smd 0.889 x 0.889: 1 -0.762,0; 2 0.762,0
JUMPER_LARGE_2WAY = smd 1.143 x 1.143: 1 -0.75,0; 2 0.72,0
JUMPER_SMALL_2WAY = smd 0.813 x 0.61: 1 -0.508,0; 2 0.508,0
SJ_2 = smd 1.168 x 1.6: 1 -1.524,0; 2 0,0; 3 1.524,0
2X04 = drill 1.016 octagon: 1 -3.81,-1.27; 2 -3.81,1.27; 3 -1.27,-1.27; 4 -1.27,1.27; 5 1.27,-1.27; 6 1.27,1.27; 7 3.81,-1.27; 8 3.81,1.27
DFN8 = smd 0.854 x 0.3: 1 -1.477,0.75; 2 -1.477,0.25; 3 -1.477,-0.25; 4 -1.477,-0.75; 5 1.477,-0.75; 6 1.477,-0.25; 7 1.477,0.25; 8 1.477,0.75 | smd 1.397 x 2.413: HEAT 0,0
TEENSY3.0_ALLPINS/SILK = drill 0.9 pad 1.676: 3V3_A 6.35,16.51; 3V3_B 34.29,6.35; 3V3_C 19.05,11.43; A0 31.75,16.51; A1 29.21,16.51; A2 26.67,16.51; A3 24.13,16.51; A4 21.59,16.51; A5 19.05,16.51; A6 16.51,16.51; A7 13.97,16.51; A8 11.43,16.51; A9 8.89,16.51; A10 11.43,13.97; A11 13.97,13.97; A12 16.51,8.89; A13 16.51,11.43; AGND 3.81,16.51; AREF 8.89,13.97; D0 3.81,1.27; D1 6.35,1.27; D2 8.89,1.27; D3 11.43,1.27; D4 13.97,1.27; D5 16.51,1.27; D6 19.05,1.27; D7 21.59,1.27; D8 24.13,1.27; D9 26.67,1.27; D10 29.21,1.27; D11 31.75,1.27; D12 34.29,1.27; D13 34.29,16.51; D24 21.59,8.89; D25 24.13,8.89; D26 26.67,8.89; D27 29.21,8.89; D28 31.75,8.89; D29 31.75,11.43; D30 29.21,11.43; D31 26.67,11.43; D32 24.13,11.43; D33 21.59,11.43; GND_A 1.27,1.27; GND_B 34.29,8.89; GND_C 19.05,8.89; PROG 34.29,11.43; RESET 34.29,13.97; VBAT 34.29,3.81; VIN 1.27,16.51; VUSB 3.81,13.97
SOT223 = smd 1.27 x 2.286: 1 -2.286,-3.175; 2 0,-3.175; 3 2.286,-3.175 | smd 3.556 x 2.159: TER 0,3.175
SSOP28 = smd 1.5 x 0.4: 1 -3.625,4.225; 2 -3.625,3.575; 3 -3.625,2.925; 4 -3.625,2.275; 5 -3.625,1.625; 6 -3.625,0.975; 7 -3.625,0.325; 8 -3.625,-0.325; 9 -3.625,-0.975; 10 -3.625,-1.625; 11 -3.625,-2.275; 12 -3.625,-2.925; 13 -3.625,-3.575; 14 -3.625,-4.225; 15 3.625,-4.225; 16 3.625,-3.575; 17 3.625,-2.925; 18 3.625,-2.275; 19 3.625,-1.625; 20 3.625,-0.975; 21 3.625,-0.325; 22 3.625,0.325; 23 3.625,0.975; 24 3.625,1.625; 25 3.625,2.275; 26 3.625,2.925; 27 3.625,3.575; 28 3.625,4.225
RF24 = drill 1 pad 1.93: CE -1.27,1.27; CS 1.27,1.27; GND -1.27,3.81; MISO -1.27,-3.81; MOSI 1.27,-1.27; NC 1.27,-3.81; SCK -1.27,-1.27; VCC 1.27,3.81

### Placement (x,y rotation side)
BAT1  82.1,54.16 270 bottom
C1  21.59,29.84 0 top
C2  15.24,37.05 90 top
C3  15.56,50.8 180 top
C4  71.12,60.64 90 top
C5  24.7,20.8 270 top
C6  8.45,52.98 270 top
C7  21.59,43.62 270 top
C8  82.55,46.35 180 top
C9  14.3,11.7 270 top
C10  32.38,22.23 0 bottom
C11  32.38,18.41 0 bottom
C13  31.75,13.02 90 bottom
C16  14.3,38.35 270 bottom
C17  23.73,47.77 180 bottom
C18  10.07,38.02 270 top
C19  9.75,45.17 0 bottom
C20  9.75,43.23 0 bottom
D1  62.87,59.05 90 top
D2  95.57,25.4 270 bottom
D3  19.25,23.6 0 top
D4  60.96,59.05 90 top
D5  59.05,59.05 90 top
D6  66.04,59.05 270 top
D7  96.65,1.42 0 top
D8  24.05,3.9 90 top
D9  18.85,3.9 90 top
D10  34.92,23.7 270 top
D11  11.05,28.6 270 top
D12  3.9,27.95 180 top
D13  3.9,26 180 top
D14  91.44,25.4 270 bottom
F1  28.79,23.5 90 top
F2  84.77,24.77 90 bottom
J1  6.32,20.39 0 top
J2  69,52.5 0 top
J3  91,52.5 180 top
J4  80.64,57.78 90 top
J5  11.05,3.9 0 top
J6  2.92,34.45 270 top
J7  36.4,32.17 270 top
JP3  24.77,13.34 0 top
JP4  76.83,5.08 180 top
JP5  30.86,57.78 180 top
JP6  34.92,9.53 180 top
JP7  52.7,57.78 180 top
JP8  52.7,9.53 180 top
JP9  53.98,34.92 270 top
JP11  94.39,42.98 90 top
JP12  76.83,7.62 0 top
K3  44.45,1.27 0 top
K4  33.66,1.27 0 top
L1  7.15,30.88 90 top
L2  7.15,38.02 90 top
PAD1  97.18,42.98 270 bottom
PAD2  97.18,45.52 270 bottom
PAD3  97.18,48.06 270 bottom
PAD4  97.18,50.6 270 bottom
PAD6  88.9,20 90 bottom
Q1  38.73,26.33 270 top
R1  47.77,18.85 90 bottom
R2  50.05,18.85 90 bottom
R3  71.44,54.29 90 top
R4  79.06,42.55 270 top
R5  73.66,33.4 90 bottom
R6  71.12,33.4 90 bottom
R7  68.58,33.4 90 bottom
R8  66.04,33.4 90 bottom
R9  63.5,33.4 90 bottom
R10  50.16,13.72 90 bottom
R11  47.62,13.72 90 bottom
R12  44.45,13.72 90 bottom
R13  93.98,33.4 90 bottom
R14  91.44,33.4 90 bottom
R15  88.9,33.4 90 bottom
R16  86.36,33.4 90 bottom
R17  83.82,33.4 90 bottom
R18  81.28,33.4 90 bottom
R19  78.74,33.4 90 bottom
R20  76.2,33.4 90 bottom
R21  41.91,13.72 90 bottom
R22  39.37,13.72 90 bottom
R23  36.83,13.72 90 bottom
R24  60.96,33.4 90 bottom
R25  38.45,5.63 90 top
R26  66.04,55.88 90 top
R27  34.12,28.27 0 top
R28  21.45,3.9 270 top
R29  28.05,5.63 90 top
R30  96.65,4.59 0 top
R31  62.87,55.88 270 top
R32  60.96,55.88 270 top
R33  59.05,55.88 270 top
R34  42.25,31.2 180 top
R35  46.8,30.55 90 top
R36  7.15,27.95 0 top
R37  7.15,26 0 top
R38  24.38,43.23 180 bottom
R39  24.38,44.52 180 bottom
R40  27.98,43.48 270 bottom
SJ1  31.39,23.36 270 top
SJ2  62.23,55.24 0 bottom
SJ3  81.92,37.47 180 top
SJ4  69.85,37.47 0 top
SJ5  47.77,22.1 90 bottom
SJ6  50.05,22.1 90 bottom
SJ7  21.59,49.97 270 top
SJ8  81.92,42.55 90 top
SJ9  39.69,21.89 180 top
SJ10  84.77,20 180 bottom
SJ11  53.28,5.08 0 top
SJ12  15.24,30.58 90 top
SJ13  53.28,3.17 0 top
SJ14  24.38,50.38 270 bottom
SJ15  98.42,24.13 90 bottom
SJ16  28.93,50.38 270 bottom
SJ17  35.1,60.45 180 bottom
SJ18  87.31,26.99 270 bottom
SJ19  87.31,22.54 90 bottom
SV1  40.01,49.53 0 top
SV2  31.75,42.55 90 top
SV3  48.26,42.55 90 top
U1  43.18,27.6 0 top
U2  97.79,31.75 180 top
U3  21.91,35.56 270 top
U4  15.24,45.09 90 top
U5  16.9,45.5 0 bottom
U6  3.81,48.26 0 top
U$1  88.1,35.6 180 top
U$2  68.62,34.23 180 top

### Tracks (layer width: path | path; a pad name or v marks a point on that pad's centre or on a via)
3.3V  (via drill 0.5, 0.6, 0.9)
  Top 0.254: 24.7,9.46 JP6.5 | 27.94,40.63 27.94,41.59 27.95,41.6
  Top 0.356: 81.79,49.61 J4.4 | 67.18,59.82 67.31,59.69 | 71.03,61.5 C4.2 71.12,61.59
  Top 0.406: 81.79,49.61 C8.2 v79.06,46.35 R4.1 | D6.+ 67.18,59.82 | 71.03,61.5 J2.1 67.85,61.5 67.31,60.96 67.31,59.69 67.31,51.44 65.41,49.53 59.69,49.53 58.42,48.26 v55.88,48.26 | v72.39,46.35 71.12,47.62 71.12,50.8 73.03,52.7 73.03,53.98 | R3.2 71.94,55.05 73.03,53.98 | 73.03,53.98 74.93,55.88 74.93,61.59 73.98,62.55 71.44,62.55 71.12,62.23 C4.2 | U6.VCC 8.48,52.07 C6.2 8.45,42.25 10.07,40.62 12.68,40.62 | 27.94,40.63 v27.95,40.62 | 18.2,40.62 12.68,40.62 | 12.68,40.62 v12.68,39.33 | R37.2 R36.2 7.91,28.71 8.45,29.25 v8.45,33.15 | v18.2,39.65 18.2,40.62 | D7.+ 92.54,1.42 92.08,1.89 JP4.1 | R25.2 R29.2 26.11,6.39 24.7,7.8 24.7,9.46 | v27.95,40.62 18.2,40.62 | v33.85,48.06 29.21,48.06 27.95,46.8 27.95,41.6 v27.95,40.62
  Top 0.762: JP4.1 JP12.13 | SV2.5 v41.27,43.81 | v41.27,32.7 v48.9,32.7 | U2.3V3_A 91.44,19.05 90.17,20.32 87.63,20.32 85.72,22.23 | 85.72,22.23 82.55,25.4 v80.64,25.4 | U2.3V3_C 80.64,18.41 81.92,18.41 85.72,22.23
  Bottom 0.254: 27.98,40.65 v27.95,40.62
  Bottom 0.406: v79.06,46.35 v72.39,46.35 | v55.88,48.26 46.35,48.26 45.4,47.31 45.4,44.13 45.72,43.81 | 46.35,43.81 SV3.6 | v33.85,48.06 34.92,46.99 34.92,44.45 34.29,43.81 SV2.5 | v12.68,39.33 12.68,34.45 11.38,33.15 v8.45,33.15 | 23.07,47.77 C17.1 U5.4 19.18,47.77 18.2,46.8 v18.2,39.65 | R40.2 27.98,40.65
  Bottom 0.762: JP6.5 24.77,11.43 | 24.77,11.43 JP3.1 | U2.3V3_A 91.44,10.79 92.08,10.16 JP12.13 | v41.27,43.81 SV1.5 | v41.27,43.81 v41.27,32.7 | SV3.6 45.72,43.81 v41.27,43.81 | 48.9,22.73 v48.9,32.7 | 48.9,22.73 SJ5.2 46.13,22.73 45.16,21.76 35.69,21.76 C10.+ C11.+ 35.18,12.32 34.42,11.56 C13.+ 31.75,11.43 24.77,11.43 | 48.9,22.73 SJ6.2 60.2,22.73 62.87,25.4 U2.3V3_B v80.64,25.4 | 24.77,11.43 20.32,11.43 19.68,10.79 JP6.7
+5V  (via drill 0.9)
  Top 0.762: SV2.7 43.81,46.35 | 43.81,46.35 SV3.8 | SV1.7 43.81,46.35 | JP6.4 JP3.2 | 43.81,46.35 43.81,38.73 41.91,36.83 32.93,36.83 v31.85,35.75 v27.3,31.2
  Bottom 0.762: v27.3,31.2 JP3.2 | J7.2 36.4,34.45 35.1,35.75 v31.85,35.75
A0
  Bottom 0.254: R23.1 36.83,12.7 JP8.6
A1
  Bottom 0.254: R22.1 39.37,12.7 JP8.5
A2
  Bottom 0.254: R21.1 41.91,12.7 JP8.4
A3
  Bottom 0.254: R12.1 44.45,12.7 JP8.3
A4  (via drill 0.45)
  Top 0.254: v8.26,10.16 6.99,10.16 0.95,16.19 0.95,61.91 1.91,62.87 9.53,62.87 10.54,61.85 JP5.9
  Bottom 0.254: R1.1 47.41,17.88 46.35,16.82 46.35,13.97 47.37,12.95 R11.1 47.62,12.06 JP8.2 50.16,6.99 48.9,5.71 12.7,5.71 v8.26,10.16
A5
  Bottom 0.254: R2.1 50.38,17.88 51.44,16.82 51.44,13.21 51.18,12.95 | 51.18,12.95 52.7,11.43 JP8.1 52.7,6.35 51.44,5.08 12.06,5.08 0.95,16.19 0.95,59.37 2.54,60.96 6.99,60.96 8,59.94 JP5.10 | R10.1 51.18,12.95
A6
  Bottom 0.152: U2.A6 81.28,8.89 | 80.64,8.26 80.64,6.35 JP4.6
  Bottom 0.254: 81.28,8.89 80.64,8.26
A7
  Bottom 0.152: U2.A7 83.82,8.89 | 83.19,8.26 83.19,6.35 JP4.5
  Bottom 0.254: 83.82,8.89 83.19,8.26
A8
  Bottom 0.152: U2.A8 86.36,8.89 | 85.72,8.26 85.72,6.35 JP4.4
  Bottom 0.254: 86.36,8.89 85.72,8.26
A9
  Bottom 0.152: U2.A9 88.9,14.61 88.27,13.97 88.27,6.35 JP4.3
A10
  Bottom 0.152: U2.A10 87.63,16.51 87.63,8.26 JP12.11
A11
  Bottom 0.152: U2.A11 85.09,16.51 85.09,8.26
  Bottom 0.254: 85.09,8.26 JP12.10
A12
  Bottom 0.152: 82.55,16.51 82.55,8.26
  Bottom 0.254: 82.55,8.26 JP12.9 | U2.A12 81.28,22.23 81.92,21.59 82.55,20.95 82.55,16.51
A13
  Bottom 0.152: 80.01,8.26 80.01,19.05 U2.A13
  Bottom 0.254: 80.01,8.26 JP12.8
AGND
  Top 0.152: U2.AGND 88.27,9.53 88.27,6.35 JP4.2
ARDUINO_SHIELD_VIN_PIN
  Top 0.762: 14.66,21.34 J1.+
  Top 1.016: JP6.1 34.92,16.82 33.66,18.09 33.65,18.1 31.2,18.1 | D11.- 11.05,22.1 11.81,21.34 14.66,21.34 F1.1 28.79,19.11 29.8,18.1 31.2,18.1 | SJ1.2 31.39,18.29 31.2,18.1
AREF  (via drill 0.33, 0.45)
  Top 0.254: JP5.8 13.08,60.71 13.97,61.59 57.15,61.59 57.78,60.96 57.78,54.61 58.42,53.98 62.23,53.98 v62.87,53.34 | v64.45,46.67 64.45,44.45 67.63,41.27 73.78,41.27 74.75,42.25 v74.75,43.55 | v87.42,43.55 87.42,41.27 87.75,40.95 v87.75,39
  Bottom 0.203: 87.63,31.75 87.63,29.84
  Bottom 0.254: v62.87,53.34 64.14,52.07 64.14,46.99 v64.45,46.67 | v87.75,39 87.63,31.75 | v74.75,43.55 78,43.55 78.33,43.23 83.53,43.23 84.5,44.2 86.78,44.2 v87.42,43.55 | 87.63,29.84 87.63,29.53 87,28.89 83.5,28.89 82.55,27.94 82.55,21.91 83.5,20.95 84.02,20.43 SJ10.1
BAT_CHARGER_IN  (via drill 0.9)
  Top 0.762: v36.2,41.27 SV2.3
  Bottom 0.762: SV1.1 v36.2,41.27 36.2,38.55 38.94,35.81 J7.1
BAT_CHARGER_OUT  (via drill 0.9)
  Top 0.305: U1.5 v44.66,25.17 | 44.66,29.71 U1.8
  Top 0.762: v44.77,29.82 44.66,29.71 | J5.+ 10.05,11.35 11.67,12.97 C9.+ 17.55,12.97 17.55,13 20.8,16.25 v31.85,16.25
  Bottom 0.762: SV3.4 44.77,39.05 v44.77,29.82 44.77,25.28 v44.66,25.17 34.6,25.17 31.85,22.43 v31.85,16.25
D0
  Bottom 0.254: R13.2 93.98,37.72 89.79,41.91 72.01,41.91 71.12,42.8 71.12,58.42 70.04,59.5 J2.2 54.42,59.5 JP7.1
D1
  Bottom 0.254: JP7.2 52.07,55.88 54.61,55.88 56.23,57.5 J2.3 70.14,57.5 70.48,57.15 70.48,42.55 71.75,41.27 89.53,41.27 91.44,39.37 R14.2
D2
  Bottom 0.254: JP7.3 50.16,55.24 SJ2.2 61.72,53.21 63.5,51.44 63.5,46.35 69.22,40.64 87.63,40.64 88.9,39.37 R15.2
D3
  Bottom 0.254: R16.2 86.36,38.73 85.09,40.01 69.09,40.01 62.87,46.23 62.87,51.18 59.44,54.61 48.26,54.61 JP7.4
D4  (via drill 0.45)
  Top 0.254: SJ3.1 v85.09,37.47
  Bottom 0.254: JP7.5 46.35,53.98 59.05,53.98 62.23,50.8 62.23,45.97 68.83,39.37 82.55,39.37 83.82,38.1 83.82,37.47 | 83.82,37.47 R17.2 | v85.09,37.47 83.82,37.47
D5
  Bottom 0.254: JP7.6 44.45,53.34 58.8,53.34 61.59,50.55 61.59,45.72 68.58,38.73 80.01,38.73 81.28,37.47 R18.2
D6  (via drill 0.45)
  Top 0.254: SJ3.3 79.38,37.47 v78.74,36.83
  Bottom 0.254: R19.2 v78.74,36.83 77.47,38.1 68.33,38.1 60.96,45.47 60.96,50.29 58.55,52.7 42.55,52.7 JP7.7 37.41,57.78 37.41,60.09 37.05,60.45 SJ17.2
D7  (via drill 0.5)
  Top 0.254: v26,51.02 v32.83,51.02
  Bottom 0.254: R20.2 76.2,36.83 75.56,37.47 68.07,37.47 60.33,45.21 60.33,50.04 58.29,52.07 40.64,52.07 JP7.8 34.92,53.12 v32.83,51.02 | SJ14.1 25.98,51.01 v26,51.02
D8  (via drill 0.33)
  Top 0.254: v57.53,51.05 52.39,56.2 32.45,56.2 JP5.1
  Bottom 0.254: v57.53,51.05 59.69,48.9 59.69,44.96 67.82,36.83 73.03,36.83 73.66,36.2 R5.2 | SJ16.1 30.21,51.01 30.86,51.66 JP5.1
D9  (via drill 0.33, 0.45 pad 0.25)
  Top 0.254: v56.39,51.05 51.75,55.56 30.54,55.56 JP5.2 | v71.12,35.24 71.37,35.5 SJ4.3 71.37,39.12 71.12,39.37 67.69,39.37 66.04,37.72 v66.04,36.83
  Bottom 0.254: v56.39,51.05 59.05,48.39 59.05,44.7 66.04,37.72 v66.04,36.83 | R6.2 v71.12,35.24
D10  (via drill 0.33, 0.45 pad 0.25)
  Top 0.254: v55.24,51.05 51.44,54.93 28.64,54.93 JP5.3 | SJ4.1 68.33,35.5 | 68.33,35.5 v68.58,35.24 | 68.33,35.5 65.47,35.5 v64.77,36.2
  Bottom 0.254: v55.24,51.05 58.42,47.88 58.42,44.45 64.77,38.1 v64.77,36.2 | R7.2 v68.58,35.24 | U6.MOSI 6.35,46.99 6.99,47.62 12.06,53.34 13.34,54.61 24.77,54.61 25.78,55.63 JP5.3
D11  (via drill 0.33, 0.45)
  Top 0.254: v72.19,35.99 73.66,37.47 76.83,37.47 77.47,38.1 77.47,51.12 78.11,51.75 80.33,51.75 80.73,51.35 J4.3 | JP9.4 v57.15,34.92 v64.77,34.92 | v57.15,39.37 58.42,40.64 58.42,43.81 54.61,47.62 54.61,48.9 55.24,49.53 58.42,49.53 59.05,50.16 59.05,52.07 56.52,54.61 56.52,59.69 55.88,60.33 24.13,60.33 23.24,59.44 JP5.4
  Bottom 0.152: U6.MISO 3.81,45.72 3.81,47.62 4.45,48.26 6.35,48.26
  Bottom 0.254: v72.19,35.99 66.47,35.99 66.04,35.56 66.04,34.92 | 66.04,34.92 R8.2 | v57.15,34.92 v57.15,39.37 | v64.77,34.92 66.04,34.92 | JP5.4 23.24,55.63 22.86,55.24 12.7,55.24 6.35,48.26
D12  (via drill 0.33, 0.45, 0.5)
  Top 0.152: 56.48,36.2 53.98,36.2 JP9.1
  Top 0.254: 56.48,36.2 v63.5,36.2 67.31,40.01 76.2,40.01 76.83,40.64 76.83,42.55 v76.62,42.76 | J4.7 85.15,44.85 v85.15,42.9 | JP9.1 52.7,51.75 50.16,54.29 22.57,54.29 20.7,56.16 JP5.5
  Bottom 0.254: R9.2 v63.5,36.2 | 76.83,42.55 76.81,42.58 | v85.15,42.9 84.5,42.9 84.17,42.58 76.81,42.58 | 76.81,42.58 v76.62,42.76
D13  (via drill 0.33, 0.45)
  Top 0.152: 56.52,33.66 53.98,33.66 JP9.3
  Top 0.254: 56.52,33.66 v56.64,33.66 | v63.5,37.47 66.67,40.64 74.93,40.64 75.56,41.27 75.56,51.75 76.2,52.39 82.23,52.39 82.93,51.69 J4.5 | JP9.3 51.12,36.51 51.12,51.44 48.9,53.66 20.64,53.66 18.16,56.13 | JP5.6 18.16,56.13 | 18.16,56.13 7.25,56.13 5.09,53.98 v3.81,53.98
  Bottom 0.152: U6.SCK 3.81,48.26 v3.81,53.98
  Bottom 0.254: R24.2 60.96,35.56 | 60.96,35.56 62.87,37.47 v63.5,37.47 | v56.64,33.66 57.47,33.66 59.37,35.56 60.96,35.56
D24
  Top 0.254: JP4.7 74.3,2.54 59.05,2.54 58.42,3.17 SJ13.2
  Bottom 0.152: U2.D24 77.47,21.59 77.47,13.97 78.11,13.34 78.11,6.35 JP4.7
D25
  Top 0.254: JP4.8 72.39,3.17 60.33,3.17 58.42,5.08 SJ11.2
  Bottom 0.152: U2.D25 74.93,21.59 74.93,13.97 75.56,13.34 75.56,6.35 JP4.8
D26
  Bottom 0.152: U2.D26 72.39,21.59 72.39,13.97 73.03,13.34 73.03,6.35 JP4.9
D27
  Bottom 0.152: U2.D27 69.85,21.59 69.85,13.97 70.48,13.34 70.48,6.35 JP4.10
D28
  Bottom 0.152: U2.D28 67.31,21.59 67.31,13.97 67.94,13.34 67.94,6.35 JP4.11
D29  (via drill 0.45)
  Top 0.152: v66.67,12.7 67.31,13.34 67.31,19.05 U2.D29
  Bottom 0.152: v66.67,12.7 JP12.3
D30  (via drill 0.45)
  Top 0.152: v69.22,12.7 69.85,13.34 69.85,19.05 U2.D30
  Bottom 0.152: v69.22,12.7 JP12.4
D31  (via drill 0.45)
  Top 0.152: v71.75,12.7 72.39,13.34 72.39,19.05 U2.D31
  Bottom 0.152: v71.75,12.7 JP12.5
D32  (via drill 0.45)
  Top 0.152: v74.3,12.7 74.93,13.34 74.93,19.05 U2.D32
  Bottom 0.152: v74.3,12.7 JP12.6
D33  (via drill 0.45)
  Top 0.152: v76.83,12.7 77.47,13.34 77.47,19.05 U2.D33
  Bottom 0.152: v76.83,12.7 JP12.7
DFGDFG
  Top 0.254: R3.1 69.03,53.53 J2.5
  Bottom 0.254: SJ2.1 64.77,55.24 66.52,53.5 J2.5
DIRECT_AREF
  Bottom 0.254: U2.AREF PAD6.1
  Bottom 0.406: SJ10.2 PAD6.1
ESDASGGGG
  Top 0.254: SJ3.2 SJ8.1 79.82,41.02 R4.2
GND  (via drill 0.4, 0.5, 0.6, 0.9)
  Top 0.254: U1.3 41.75,27.3 42.9,27.3 42.9,27.88 | U1.1 42.5,28.35 42.9,27.95 42.9,27.88 | 42.9,27.88 U1.HEAT
  Top 0.305: U1.3 42.93,27.35 U1.HEAT
  other vias: 96.65,36.07 60.45,38.48 11.68,62.74 57.4,62.74 71.88,26.8 49.98,1.13 38.97,1.61 64.77,61.47 72.39,57.66 75.22,54.05 21.94,33.34 9.14,60.83 15.49,52.58 8.14,55.22 54.1,46.1 54.1,50.23 45.82,49.58 73.66,48.13 87.31,46.55 66.99,48.45 23.62,38.86 4.71,38.86 25.51,32.51 94.05,6.23 97.83,19.13 42.58,29.61 37.34,19.39 25.49,45.83 23.44,26.99 39.91,39.86 13.77,24.62 17.52,17.77 49.24,36.09 57.36,28.94 94.9,53.43 85.48,53.76 88.22,55.35 80.09,34.87 31.95,31.18 47.77,28.93 15.28,42.9 15.93,47.45 27.59,1.29 6.14,7.79 62.98,1.13 8.61,37.24 7.64,41.14 6.99,50.89 9.59,48.94 17.06,39.51 17.06,28.46 19.84,25.74 20.66,19.52 95.29,19.13
  pour Bottom: 0.96,63.17 0.96,0.64 99.37,0.64 99.37,63.17
  pour Top: 0.64,62.85 1.28,0.64 99.05,0.64 99.05,62.85
  pour Top (no thermals): 42.57,30.01 42.7,24.15 43.56,24.2 43.74,24.78 43.74,30.04
N$1
  Top 0.762: 18.41,50.74 C3.+
  Top 1.016: U4.3 18.41,50.74 21.59,50.74 SJ7.1 23.41,50.72 25.3,52.6 48.36,52.6 49.53,51.44 SV3.7 SV3.5 SV3.3 SV3.1
N$2  (via drill 0.33, 0.45)
  Top 0.254: v60.01,61.59 60.01,55.56 59.56,55.12 R33.2 | v89.22,62.55 v75.56,62.55
  Bottom 0.254: J3.5 90.11,51.5 89.53,52.07 89.53,62.23 v89.22,62.55 | v60.01,61.59 61.91,63.5 74.61,63.5 v75.56,62.55
N$3
  Top 0.254: R31.1 D1.+
N$5
  Bottom 0.254: U2.D0 R13.1
N$6
  Bottom 0.254: U2.D1 R14.1
N$7
  Bottom 0.254: U2.D2 R15.1
N$8
  Bottom 0.254: U2.D3 R16.1
N$9
  Bottom 0.254: U2.D4 R17.1
N$10  (via drill 0.45)
  Top 0.203: 60.45,8.89 77.47,8.89 78.74,10.16 U2.A5
  Top 0.254: 60.45,8.89 57.91,11.43 53.99,11.43 52.07,13.35 52.07,15.88 51.44,16.51 v50.16,16.51
  Bottom 0.254: 49.53,14.61 50.13,14.61 R10.2 v50.16,16.51
N$11  (via drill 0.45)
  Top 0.254: U2.A4 76.2,13.34 75.56,12.7 75.56,10.16 74.93,9.53 60.71,9.53 58.42,11.81 58.42,15.88 56.52,17.78 48.9,17.78 v47.62,16.51
  Bottom 0.254: 47.62,14.61 R11.2 v47.62,16.51
N$12  (via drill 0.45)
  Top 0.254: U2.A3 73.66,13.34 73.03,12.7 73.03,10.79 72.39,10.16 60.96,10.16 59.05,12.06 59.05,16.13 56.77,18.41 46.35,18.41 v44.45,16.51
  Bottom 0.254: v44.45,16.51 R12.2
N$13
  Bottom 0.254: U2.D5 R18.1
N$14
  Bottom 0.254: U2.D6 R19.1
N$15
  Bottom 0.254: U2.D7 R20.1
N$16
  Bottom 0.254: U2.D8 R5.1
N$17
  Bottom 0.254: U2.D9 R6.1
N$18
  Bottom 0.254: U2.D10 R7.1
N$19
  Bottom 0.254: U2.D11 R8.1
N$20
  Bottom 0.254: R9.1 U2.D12
N$21  (via drill 0.45)
  Top 0.254: v41.91,16.51 44.45,19.05 57.15,19.05 59.69,16.51 59.69,12.7 61.59,10.79 69.85,10.79 70.48,11.43 70.48,12.7 71.12,13.34 U2.A2
  Bottom 0.254: v41.91,16.51 R21.2
N$22  (via drill 0.45)
  Top 0.254: v39.37,16.51 42.55,19.68 57.4,19.68 60.33,16.76 60.33,13.34 62.23,11.43 67.31,11.43 67.94,12.06 67.94,12.7 68.58,13.34 U2.A1
  Bottom 0.254: R22.2 v39.37,16.51
N$23  (via drill 0.45)
  Top 0.254: v36.83,16.51 40.64,20.32 57.78,20.32 60.96,17.14 60.96,13.97 61.59,13.34 65.41,13.34 66.04,13.97 U2.A0
  Bottom 0.254: v36.83,16.51 R23.2
N$24  (via drill 0.45)
  Top 0.254: U2.D13 61.59,17.14 61.59,18.03 60.96,18.67 v60.96,25.4
  Bottom 0.254: v60.96,25.4 R24.1
N$25
  Top 0.254: R32.1 D4.+
N$26
  Top 0.254: R32.2 61.47,55.12 61.91,55.56 61.91,62.87 62.55,63.5 92.08,63.5 92.71,62.87 92.71,48.26 91.95,47.5 J3.3
N$27
  Top 1.016: U4.TER U4.2 C7.+ SJ7.2 25.2,49.24 25.35,49.4 25.48,49.53 33.88,49.53 35.15,50.8 SV1.2 SV1.4 SV1.6 SV1.8
N$28
  Bottom 0.254: SJ5.1 R1.2
N$29
  Top 0.254: R33.1 D5.+
N$30  (via drill 0.33, 0.45)
  Top 0.254: R26.1 66.04,51.44 v65.72,51.12 | v65.41,45.72 65.41,44.45 67.94,41.91 72.39,41.91 73.03,42.55 v73.03,43.18 | SJ8.3 80.39,44.07 v80.33,44.13
  Bottom 0.254: v65.72,51.12 65.72,46.04 v65.41,45.72 | v80.33,44.13 76.52,44.13 76.2,44.45 74.3,44.45 v73.03,43.18
N$31  (via drill 0.45)
  Top 0.254: R31.2 62.99,55.12 v64.14,53.98
  Bottom 0.254: v64.14,53.98 66.61,51.5 J2.6
N$32
  Bottom 0.254: SJ6.1 R2.2
N$33
  Top 0.254: D6.- R26.2
N$34
  Top 0.406: D7.- R30.2
N$35
  Top 0.254: SJ8.2 83.19,42.55 84.14,41.59 85.72,41.59 86.36,42.23 86.36,47.62 87.33,48.6 J4.9
N$36  (via drill 0.5, 0.9)
  Top 0.305: U1.4 41.7,24.85
  Top 0.406: R28.1 21.45,5.85 20.8,6.5 17.55,6.5 15.6,8.45 15.6,10.4 16.9,11.7 18.2,11.7 21.45,14.95 32.5,14.95 v33.48,15.93 | v33.15,19.5 33.15,19.71 D10.-
  Top 0.762: 41.7,24.85 41.69,24.73 v41.65,23.79 41.91,23.79 | Q1.2 37.72,24.17 v37.47,23.79 35.49,23.79 34.92,23.23 D10.-
  Bottom 0.406: v33.48,15.93 33.48,19.18 v33.15,19.5
  Bottom 0.762: v37.47,23.79 v41.65,23.79
N$37
  Top 0.254: J4.2 79.63,48.52 78.11,46.99 78.11,37.47 77.47,36.83 74.3,36.83 71.91,34.45 70.48,34.45 69.85,35.08 SJ4.2
N$38  (via drill 0.6)
  Top 0.406: L2.2 8.45,38.79 | 8.45,38.79 C18.1 11.26,38.79 12.35,37.7 12.35,33.8 11.05,32.5 D11.+ | v8.45,40.3 8.45,38.79
  Bottom 0.406: 10.51,44.2 C20.1 10.51,42.36 v8.45,40.3 | 10.51,44.2 10.51,45.05 C19.1 | U5.20 12.03,44.52 11.7,44.2 10.51,44.2
N$39  (via drill 0.4)
  Top 0.254: U1.7 56.65,27.85 57.2,27.3 v57.2,21.45 | v26,2.6 26,3.9 25.24,4.66 D8.-
  Bottom 0.254: v57.2,21.45 57.2,17.55 57.85,16.9 57.85,4.55 57.2,3.9 27.3,3.9 v26,2.6
N$40  (via drill 0.4)
  Top 0.254: U1.6 55.2,27.35 55.9,26.65 v55.9,21.45 | v16.9,3.25 16.9,3.9 17.66,4.66 D9.-
  Bottom 0.254: v55.9,21.45 55.9,19.5 52.65,16.25 52.65,13 53.95,11.7 56.55,11.7 57.2,11.05 57.2,5.2 56.55,4.55 18.2,4.55 v16.9,3.25
N$41
  Top 0.406: D9.+ R28.2 D8.+
N$42
  Top 0.254: U1.2 41.05,27.85 40.62,28.27 40.62,30.34 R34.2
N$43
  Top 0.762: Q1.3 39.75,24.81 39.05,24.11 SJ9.2
N$44  (via drill 0.5)
  Top 0.406: J6.2 8.45,35.1 v9.1,35.75
  Bottom 0.406: U5.16 11.38,41.92 9.75,40.3 9.75,36.4 v9.1,35.75
N$45  (via drill 0.5)
  Top 0.406: J6.3 9.75,34.45 v10.4,35.1
  Bottom 0.406: U5.15 12.03,41.27 11.05,40.3 11.05,35.75 v10.4,35.1
N$46
  Bottom 0.254: U5.11 R38.1
N$47
  Bottom 0.762: JP11.1 PAD1.1
N$48
  Bottom 0.254: U5.9 R39.1
N$49
  Bottom 0.762: JP11.2 PAD2.1
N$50
  Bottom 0.762: PAD3.1 JP11.3
N$51
  Bottom 0.762: JP11.4 PAD4.1
N$52
  Bottom 0.254: U5.1 24.36,49.73 SJ14.2
N$53
  Top 0.762: 19.05,35.56 U3.2
  Top 1.016: SV2.8 SV2.6 SV2.4 SV2.2 30.48,37.47 28.57,35.56 U3.TER 19.05,35.56 | U3.2 15.27,35.56 C2.+ SJ12.2
N$54
  Bottom 0.254: SJ16.2 27.32,49.74 26.65,49.08 26.65,47.45 26,46.8 22.1,46.8 21.77,47.12 U5.5
N$55  (via drill 0.5)
  Top 0.254: v4.55,29.25 4.44,29.25 D12.-
  Bottom 0.254: U5.23 12.35,46.48 11.05,47.77 8.12,47.77 6.83,46.48 6.83,44.2 6.17,43.55 6.17,29.57 5.85,29.25 v4.55,29.25
N$56
  Bottom 0.254: SJ17.1 33.15,60.45 32.5,59.8 32.5,52.65 31.85,52 31.85,49.4 30.55,48.1 28.6,48.1 27.95,47.45 27.95,44.26 R40.1 26.65,42.91 26.65,41.6 26.32,41.27 U5.14
N$57  (via drill 0.5)
  Top 0.254: v5.53,26.98 4.11,26.98 D13.-
  Bottom 0.254: v5.53,26.98 6.83,28.27 6.83,43.23 7.47,43.88 7.47,46.15 8.45,47.12 10.72,47.12 12.03,45.83 U5.22
N$58
  Top 0.254: R34.1 43.12,31.31 R35.2
N$59  (via drill 0.7)
  Top 0.61: v84.77,25.4 86.04,25.4 86.68,26.04 92.71,26.04 v93.34,25.4
  Bottom 0.61: F2.2 v84.77,25.4 | v93.34,25.4 93.34,26.04 92.08,27.3 91.75,27.3 D14.+
N$60
  Bottom 0.254: U5.17 14.3,42.58 14.62,42.25 14.62,40.62 14.3,40.3 C16.1
N$61
  Top 0.254: D12.+ R36.1
N$62
  Top 0.254: D13.+ R37.1
N$63
  Top 0.406: J6.5 6.5,33.15 7.15,32.5 L1.2
N$64
  Top 0.406: J6.1 6.5,35.75 7.15,36.4 L2.1
N$65
  Bottom 0.61: SJ19.1 87.11,21.79 86.16,21.79 85.72,22.23 85.15,22.23 F2.1
NET45456
  Top 0.762: 37.78,27.28 Q1.1 36.66,28.27 36.4,28.27 | D10.+ 34.89,25.95 R27.2 36.4,28.27 | J7.5 J7.6 | J7.4 J7.5 | J7.5 36.4,28.27
PROG  (via drill 0.4, 0.45 pad 0.25)
  Top 0.152: JP12.2 62.87,6.35 v60.33,6.35
  Top 0.254: 42.55,3.17 K3.1 | R25.1 38.45,3.8 39.33,2.92 K3.1 | K3.1 43.22,2.92 44.85,4.55 49.4,4.55 52,1.95 v56.55,1.95
  Bottom 0.152: 64.77,19.05 64.77,8.26 JP12.2
  Bottom 0.254: U2.PROG 64.77,19.05 | v60.33,6.35 59.15,5.17 59.15,3.25 57.85,1.95 v56.55,1.95
RESET  (via drill 0.4)
  Top 0.254: JP6.6 22.23,7.67 24.05,5.85 25.35,5.85 26.33,4.87 R29.1 28.28,4.87 30.23,2.92 K4.1 33.15,2.92 v33.48,2.6
  Bottom 0.254: U2.RESET 60.33,20.95 59.05,20.95 58.42,20.32 58.42,3.82 57.85,3.25 34.12,3.25 v33.48,2.6 | JP6.6 22.23,8.9 21.45,8.12 14.62,8.12 13.65,9.1 13.65,13 15.6,14.95 15.6,40.95 16.25,41.6 16.25,43.55 15.93,43.88 U5.19
RF_CE  (via drill 0.45, 0.5)
  Top 0.152: U6.CE 3.81,48.26 3.81,43.18
  Top 0.254: SJ13.1 52.07,3.17 v48.26,6.99 | v1.91,41.27 3.81,43.18
  Bottom 0.254: v48.26,6.99 47.62,6.35 13.34,6.35 1.91,17.78 v1.91,41.27
RF_CS  (via drill 0.45, 0.5)
  Top 0.254: SJ11.1 52.07,5.08 49.21,7.94 46.67,7.94 v46.35,7.62 | U6.CS 6.35,49.53 6.99,48.9 6.99,42.73 5.55,41.3 v3.17,41.3
  Bottom 0.254: v46.35,7.62 45.72,6.99 13.97,6.99 3.17,17.78 v3.17,41.3
T3_VIN  (via drill 0.7)
  Top 0.61: SV2.1 v38.73,38.73 41.98,38.73 v42.58,39.33 | v97.79,33.02 85.72,33.02 85.09,32.38 62.23,32.38 61.59,31.75 57.78,31.75 56.52,30.48 51.44,30.48 50.8,31.11 50.8,33.66 49.85,34.61 46.67,34.61 46.04,33.97 v42.63,33.97
  Bottom 0.406: 42.58,34.03 v42.63,33.97 | 98.42,27.61 98.42,27.3
  Bottom 0.61: SV1.3 v38.73,38.73 | v97.79,33.02 98.42,32.38 98.42,28.57 98.42,27.3 SJ15.2 | v42.58,39.33 42.58,34.03 | D2.+ 98.42,27.61
VBAT  (via drill 0.45)
  Top 0.203: 90.17,29.21 v90.17,31.75
  Top 0.254: v89.53,40.01 88.58,40.96 v88.58,45.13 | U2.VBAT 60.93,27.94 59.69,26.7 v59.69,19.68 | 90.17,29.21 88.9,27.94 v80.64,27.94
  Bottom 0.152: 59.69,11.43 62.87,8.26 62.87,6.35 JP4.12
  Bottom 0.254: v59.69,19.68 59.69,11.43 | v88.58,45.13 88.58,48.58 87,50.16 87,60.96 85.92,62.03 BAT1.PWR@1 | v90.17,31.75 90.17,39.37 v89.53,40.01 | v80.64,27.94 U2.VBAT
VCC
  Top 0.762: 18.8,33.21 U3.3 | 15.19,29.9 SJ12.1 | 33.8,33.53 J7.3
  Top 1.016: 18.8,33.21 C1.+ 18.78,29.83 | SV3.2 46.99,37.47 45.09,35.56 34.26,35.56 33.8,35.1 33.8,33.53 | J7.3 32.2,33.5 29.9,31.2 | SJ12.1 18.78,29.83 | 18.78,29.83 20.57,29.83 21.3,29.1 21.3,23.65 D3.2 C5.+ 24.7,25 25.3,25.6 28.73,25.6 F1.2 28.8,25.67 28.8,30.1 29.9,31.2 | SJ1.1 31.39,29.71 29.9,31.2
VIN_T3_DIRECT
  Bottom 0.406: U2.VIN 96.52,19.68 95.57,20.64 D2.- 95.44,23.38
  Bottom 0.61: D2.- D14.- 91.43,23.18 89.53,23.18 88.9,23.81 88.9,27.3 88.47,27.74 SJ18.1 | SJ15.1 95.44,23.38
VUSB  (via drill 0.7, 0.9)
  Top 0.61: U2.VUSB 93.98,21.59 92.71,22.86 90.81,24.77 v87.31,24.77
  Top 0.762: U2.VUSB 99.06,17.78 | 99.06,17.78 99.06,13.97 97.79,12.7 93.34,12.7 89.53,8.89 JP12.12 | 99.06,17.78 99.06,33.66 98.42,34.29 84.45,34.29 83.66,33.5 v59.05,33.5 | SJ9.1 44.64,21.89 46.8,24.05 51.35,24.05 v52,24.7
  Bottom 0.61: SJ18.2 v87.31,24.77 SJ19.2
  Bottom 0.762: v52,24.7 55.9,24.7 59.05,27.86 v59.05,33.5
(copper drawn outside any net)
  shapes: Top area x3

### Text on the board
Bottom: WWW.TINYTIGER.CH | 9.2013 / L3.4.5
tPlace: AREF | SCL | SDA | GND | 13 | 12 | 11 | 10 | 9 | 8 | 7 | 6 | 5 | 4 | 3 | 2 | 1 | 0 | ASSOC | /SLP | RSSI | SDC | XBEE STATUS | CHG_IN / T3_VIN / 3.3V / +5V | VCC / D- / D+ / GND | VREG2 OUT | +5V | +5V / 3.3V / CHG_OUT / EXT_IN | 3.3V | VREG2 | VREG2 IN | CHG_IN | SD CARD / CHIP SELECT | T3_VIN | SD CARD / CARD DEDECT | VREG1 OUT | VREG1 | TX | CHG INPUT | RX | EXT_IN / +5V / CHG_IN | CHARGER | 3V3 | 5V | IOREF | RST | GND | GND | VIN | A0 | A1 | A2 | A3 | A4 | A5 | GND / PROG / D29 / D30 / D31 / D32 / D33 / A13 / A12 / A11 / A10 / VUSB / 3.3V | RESET | PROGRAM | GND / VBAT / D28 / D27 / D26 / D25 / D24 / A6 / A7 / A8 / A9 / AGND / 3.3V | POWER | + - / LIPO | CHRG | DONE
bPlace: RTC BATTERY / CR1220 | USB TO TTL | I2C PULLUP | AREF
Document: WITH SEEED OPL PARTS